# EAGLE board AI_Starter_Kit_for_Jetson_Nano_V1.0 (EAGLE 9.5.1), part 1 of 3
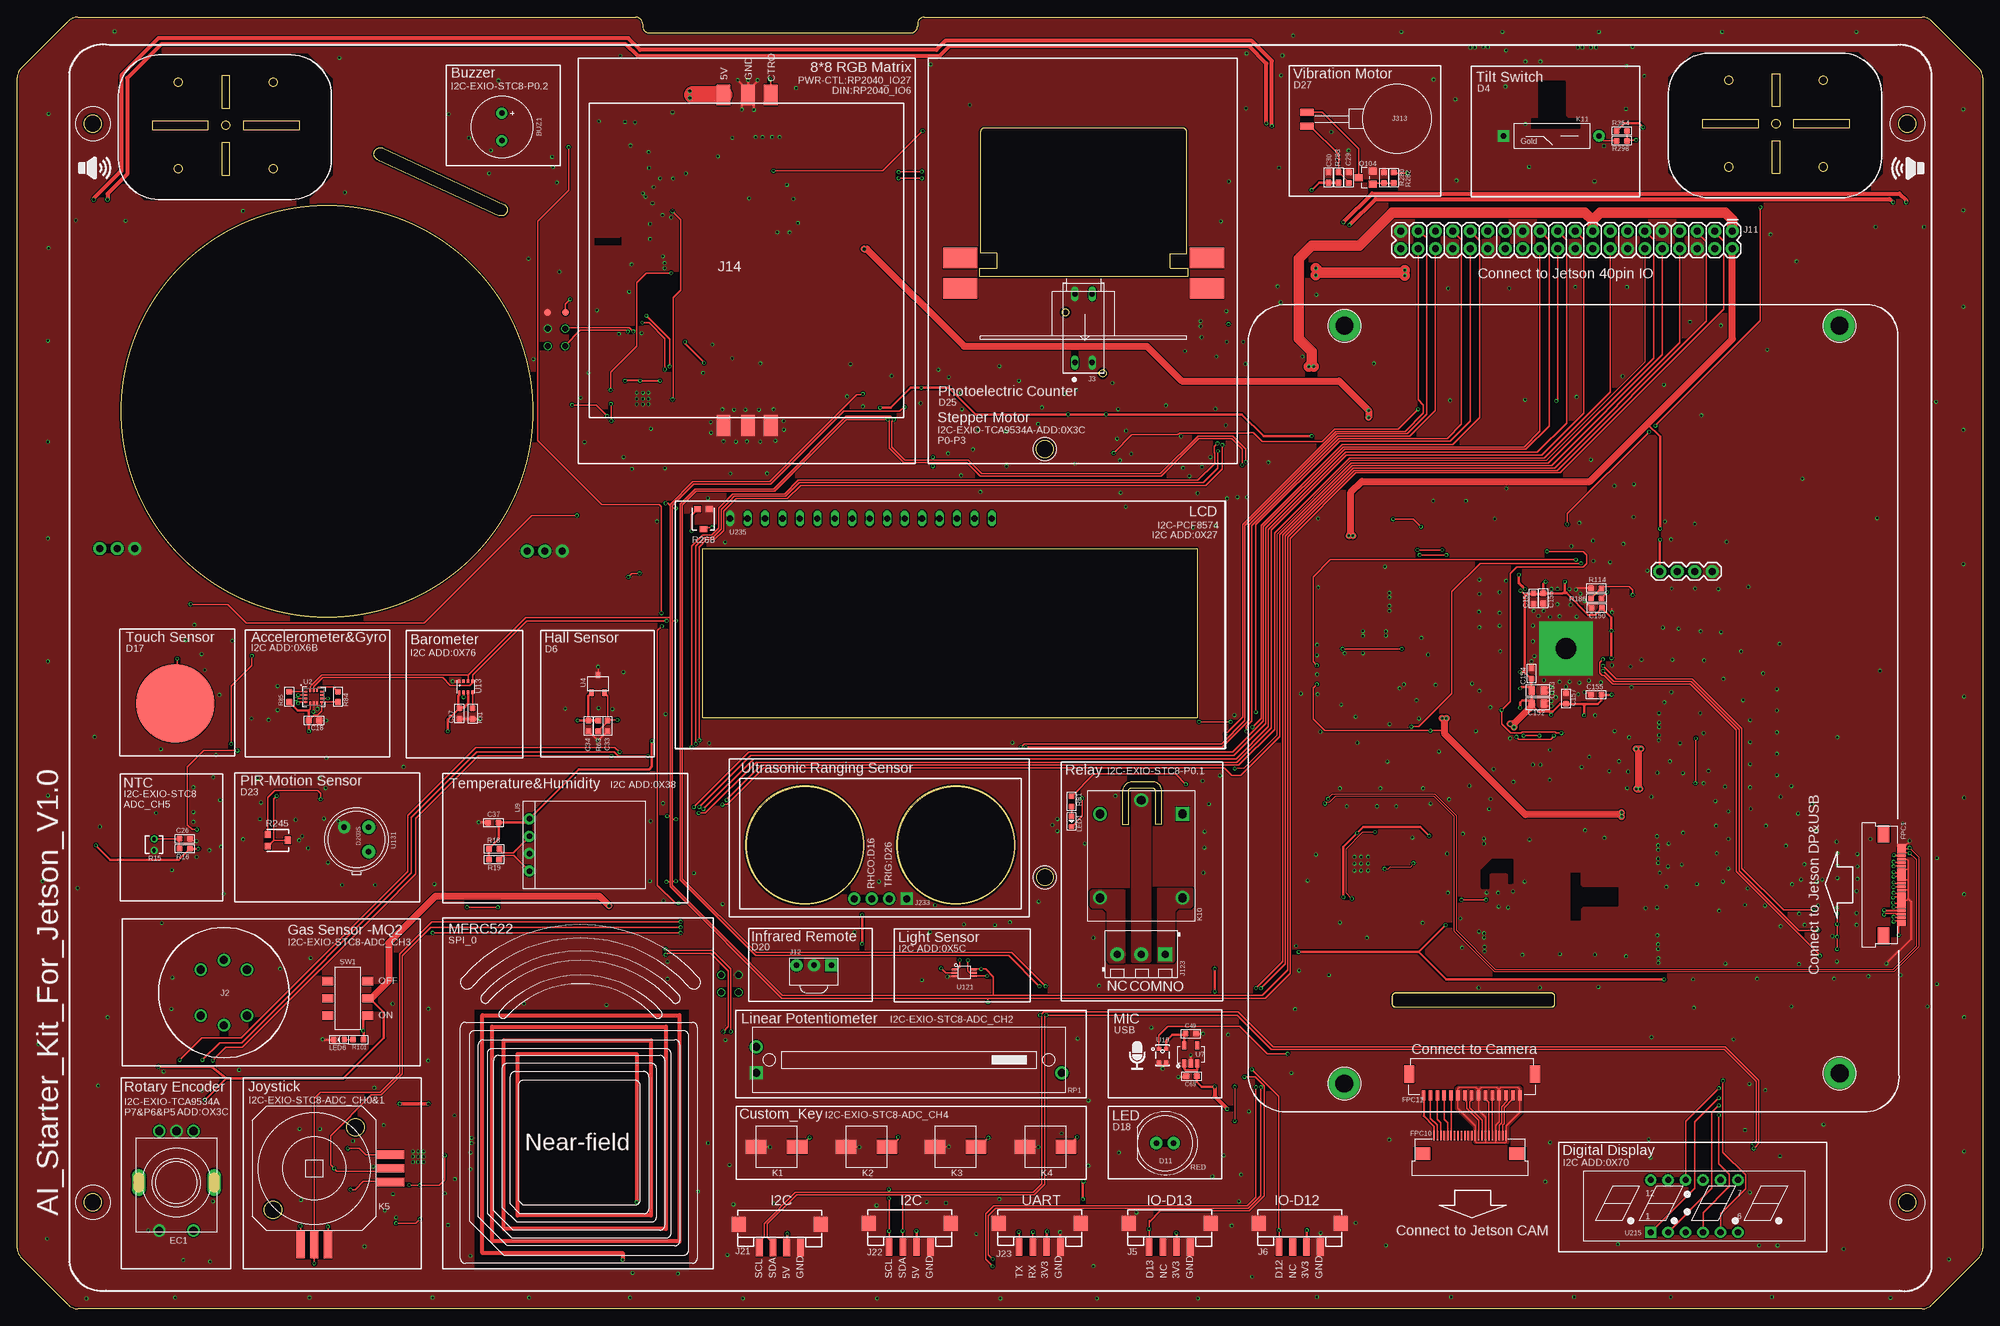
[diagram p7: board, top side]
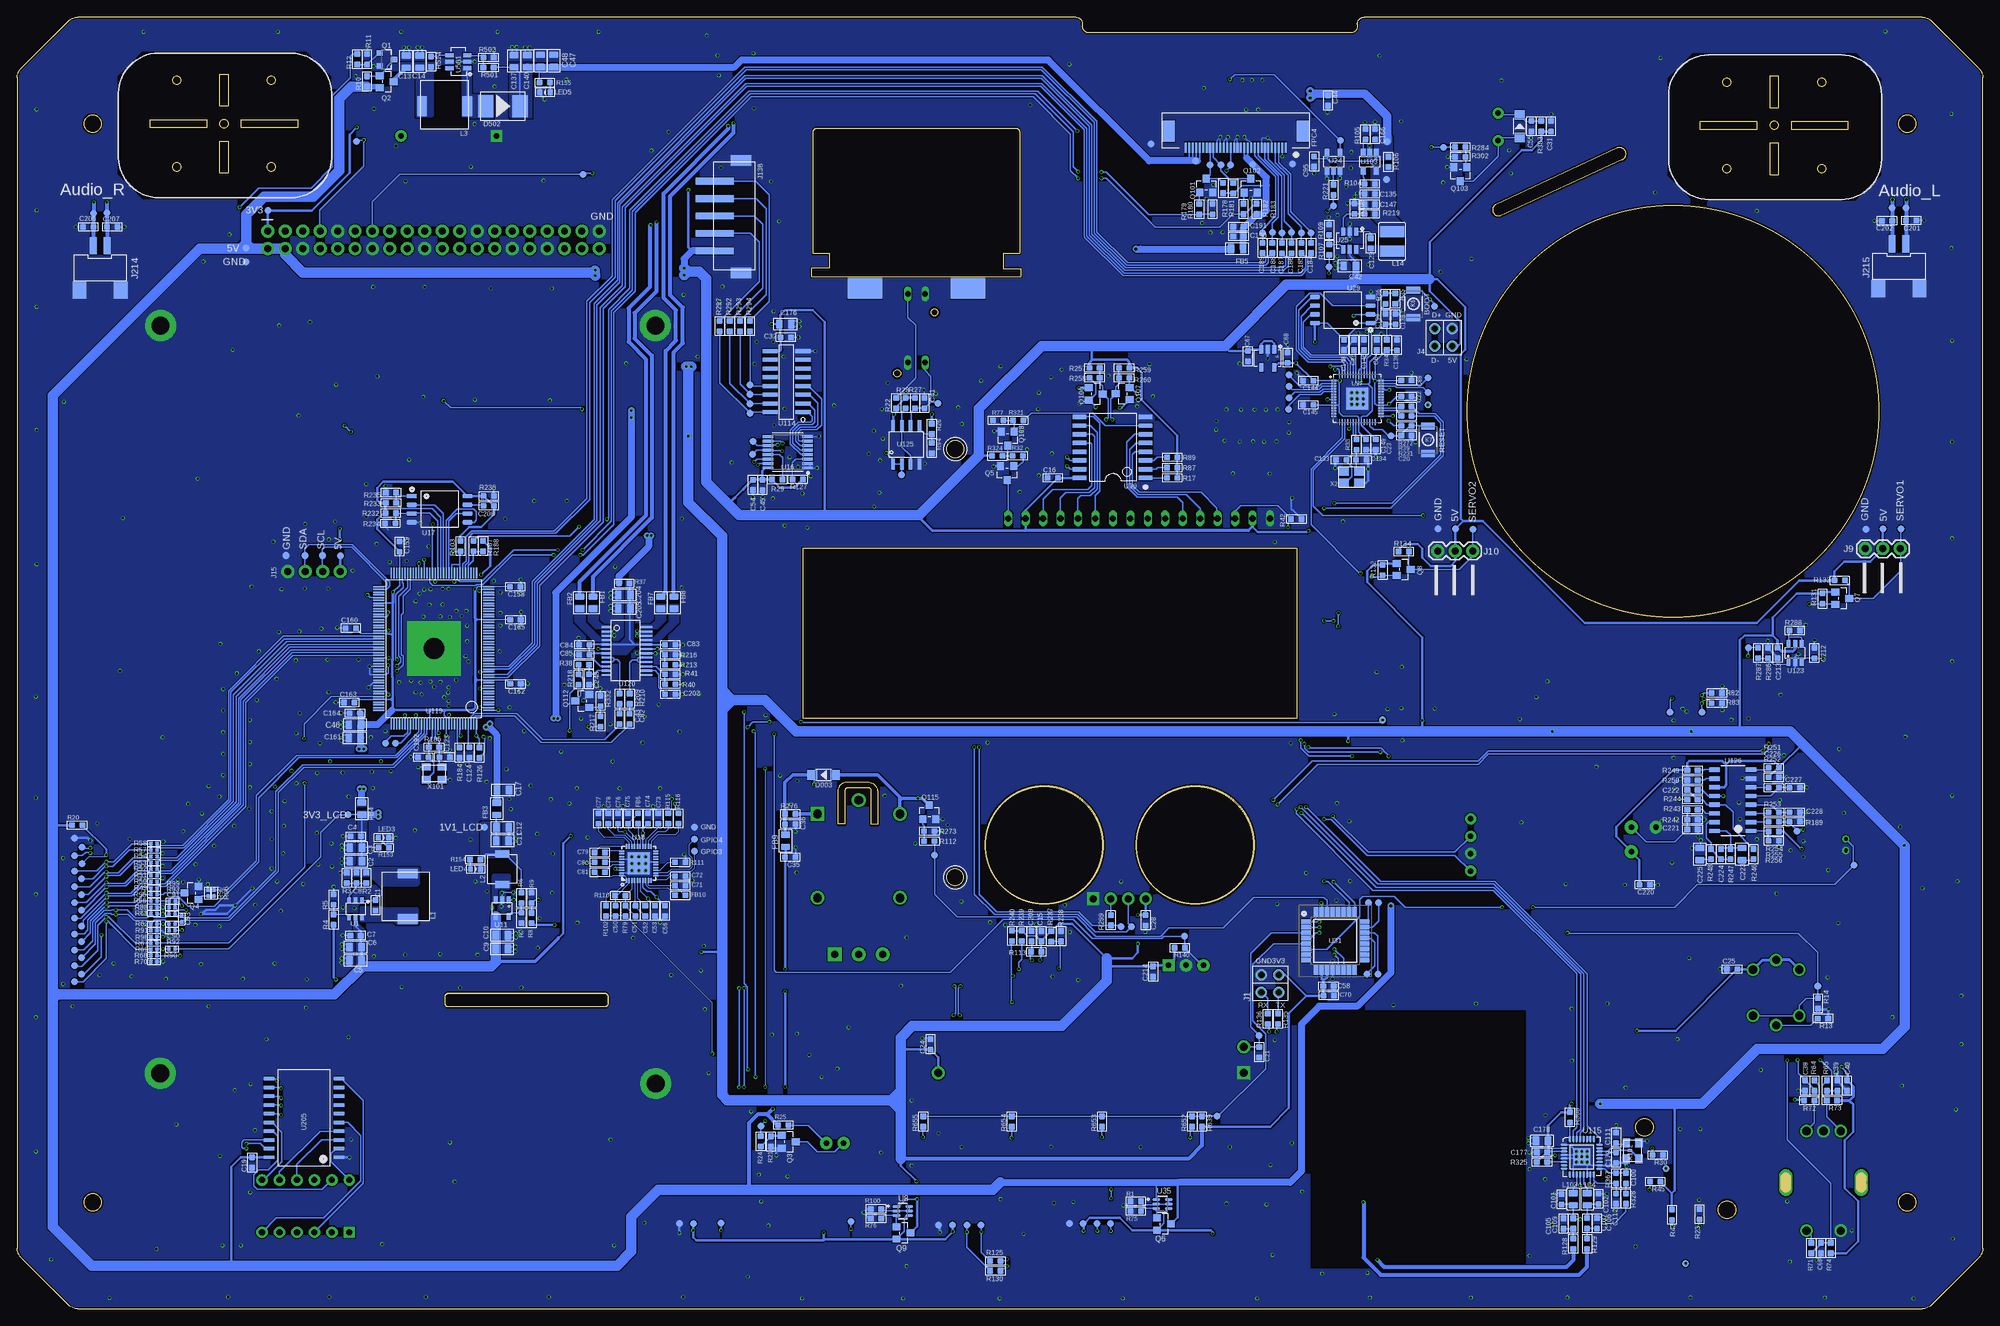
[diagram p8: board, bottom side, seen from below]

Size 286 x 188 mm. Coordinates in mm from the lower left corner, seen from the top.
Outline: 140.66,171.83 arc90 140.16,171.33
Outline: 223.75,45.35 arc90 223.17,45.92
Outline: 223.25,43.92 arc90 223.75,44.42
Outline: 200.05,44.42 arc90 200.55,43.92
Outline: 200.55,45.92 arc90 200.05,45.42
Outline: 170.16,171.33 arc90 169.66,171.83
Outline: 200.55,43.92 223.25,43.92
Outline: 223.17,45.92 200.55,45.92
Outline: 170.16,171.33 170.16,153.56 167.77,153.56 167.77,151.46 170.36,151.46 170.36,150.23 139.96,150.23 139.96,151.43 142.55,151.43 142.55,153.63 140.16,153.63 140.16,171.33
Outline: 200.05,45.42 200.05,44.42
Outline: 223.75,44.42 223.75,45.35
Outline: 169.66,171.83 140.66,171.83
Outline: 140.66,171.83 arc90 140.16,171.33
Outline: 223.75,45.35 arc90 223.17,45.92
Outline: 223.25,43.92 arc90 223.75,44.42
Outline: 200.05,44.42 arc90 200.55,43.92
Outline: 200.55,45.92 arc90 200.05,45.42
Outline: 170.16,171.33 arc90 169.66,171.83
Outline: 166.5,70.55 166.5,75.27 arc90 165.44,76.67 162.13,76.67 arc90 160.79,74.99 160.79,70.47 161.72,70.47 161.72,75.3 arc-90 162.03,75.81 165.13,75.81 arc-90 165.62,75.33 165.62,70.55 166.5,70.55
Outline: 266.64,171.9 266.64,173.1 258.44,173.1 258.44,171.9 266.64,171.9
Outline: 256.51,179.73 255.31,179.73 255.31,175.03 256.51,175.03 256.51,179.73
Outline: 253.38,173.1 245.18,173.1 245.18,171.9 253.38,171.9 253.38,173.1
Outline: 256.51,169.97 255.31,169.97 255.31,165.27 256.51,165.27 256.51,169.97
Outline: 41.08,171.65 41.08,172.85 32.88,172.85 32.88,171.65 41.08,171.65
Outline: 30.95,179.48 29.75,179.48 29.75,174.78 30.95,174.78 30.95,179.48
Outline: 27.82,172.85 19.62,172.85 19.62,171.65 27.82,171.65 27.82,172.85
Outline: 30.95,169.72 29.75,169.72 29.75,165.02 30.95,165.02 30.95,169.72
Outline: 200.54,43.96 223.24,43.96 arc90 223.74,44.46 223.74,45.46 arc90 223.24,45.96 200.54,45.96 arc90 200.04,45.46 200.04,44.46 arc90 200.54,43.96
Outline: 200.53,43.94 223.23,43.94 arc90 223.73,44.44 223.73,45.44 arc90 223.23,45.94 200.53,45.94 arc90 200.03,45.44 200.03,44.44 arc90 200.53,43.94
Outline: 0.59,180.59 7.41,187.41 arc-45 8.83,188 90,188 arc-90 91,187 91,186.7 arc90 92,185.7 130,185.7 arc90 131,186.7 131,187 arc-90 132,188 277.17,188 arc-45 278.59,187.41 285.41,180.59 arc-45 286,179.17 286,8.83 arc-45 285.41,7.41 278.59,0.59 arc-45 277.17,0 8.83,0 arc-45 7.41,0.59 0.59,7.41 arc-45 0,8.83 0,179.17 arc-45 0.59,180.59
Outline: 52.46,167.23 70.16,159.13 arc174 70.86,160.73 53.26,168.93 arc180 52.46,167.23
Outline: circle at 249.01,166.2 radius 0.6
Outline: circle at 262.81,166.2 radius 0.6
Outline: circle at 255.91,172.5 radius 0.6
Outline: circle at 249.01,178.8 radius 0.6
Outline: circle at 262.81,178.8 radius 0.6
Outline: circle at 249.01,166.2 radius 0.6
Outline: circle at 262.81,166.2 radius 0.6
Outline: circle at 255.91,172.5 radius 0.6
Outline: circle at 262.81,178.8 radius 0.6
Outline: circle at 249.01,178.8 radius 0.6
Outline: circle at 45.05,130.61 radius 29.95
Outline: circle at 249.01,166.2 radius 0.6
Outline: circle at 262.81,166.2 radius 0.6
Outline: circle at 255.91,172.5 radius 0.6
Outline: circle at 262.81,178.8 radius 0.6
Outline: circle at 249.01,178.8 radius 0.6
Outline: circle at 23.45,165.95 radius 0.6
Outline: circle at 37.25,165.95 radius 0.6
Outline: circle at 30.35,172.25 radius 0.6
Outline: circle at 23.45,178.55 radius 0.6
Copper layers (1*16): Top 0.035mm / dielectric 1.5mm / Bottom 0.035mm
Design rules "default *": minimum track width 6mil, minimum drill 0.3mm, track to track 6mil, track to pad 6mil, pad to pad 6mil, via to via 6mil, smd to smd 6mil, copper to edge 10mil, drill to drill 6mil, minimum pad ring 3mil, minimum via ring 4mil, stop-mask expansion 4mil, vias tented up to drill 100mil, thermal gap 0mil
Net classes: 0 default: width 0.1 mm, drill 0.3 mm; 1 PWR: width 0.4 mm, drill 0.25 mm; 2 gnd: width 0.15 mm, drill 0.3 mm, clearance 0.152 mm; 4 USB: width 0.203 mm, clearance 0.152 mm

## Footprints (pad centres in the part's own frame; a part is rotated, then mirrored left to right if it is on the bottom)
BUZZER_0955_DIP = drill 0.8 pad 1.6: 1 -2,0; 2 2,0
C0603 = smd 0.889 x 0.889: 1 -0.762,0; 2 0.762,0
C0805 = smd 1.016 x 1.397: 1 -0.889,0; 2 0.889,0
C0402 = smd 0.584 x 0.584: 1 -0.45,0; 2 0.45,0
D_SOD123 = smd 1.397 x 1.397: + -1.651,0; - 1.651,0
LED-8MM = drill 0.8 pad 1.8: 1 -1.27,0; 2 1.27,0
214AB = smd 2.2 x 3.2: 1 -2.5,0; 2 2.5,0
5P-13.75X11.7X6.5H = drill 1.2 pad 1.8: 1 -2.5,-7.5; 2 0,-7.5; 3 2.5,-7.5; 4 2.5,7; 5 -2.5,7 | drill 1.5 pad 2 long: P1 -5.5,0; P2 5.5,0
L0805 = smd 1.016 x 1.397: 1 -0.889,0; 2 0.889,0
L0603 = smd 0.889 x 0.889: 1 -0.762,0; 2 0.762,0
FPC_24PIN_0.5_4.3_1 = smd 0.3 x 1.3: 1 6.41,2.53; 2 5.91,2.53; 3 5.41,2.53; 4 4.91,2.53; 5 4.41,2.53; 6 3.91,2.53; 7 3.41,2.53; 8 2.91,2.53; 9 2.41,2.53; 10 1.91,2.53; 11 1.41,2.53; 12 0.91,2.53; 13 0.41,2.53; 14 -0.09,2.53; 15 -0.59,2.53; 16 -1.09,2.53; 17 -1.59,2.53; 18 -2.09,2.53; 19 -2.59,2.53; 20 -3.09,2.53; 21 -3.59,2.53; 22 -4.09,2.53; 23 -4.59,2.53; 24 -5.09,2.53 | smd 2.5 x 1.8: 25 -6.754,-0.06; 26 8.06,-0.06
30P*0.5MM = smd 0.3 x 1.5: P$1 -6.35,2.54; P$2 -5.85,2.54; P$3 -5.35,2.54; P$4 -4.85,2.54; P$5 -4.35,2.54; P$6 -3.85,2.54; P$7 -3.35,2.54; P$8 -2.85,2.54; P$9 -2.35,2.54; P$10 -1.85,2.54; P$11 -1.35,2.54; P$12 -0.85,2.54; P$13 -0.35,2.54; P$14 0.15,2.54; P$15 0.65,2.54; P$16 1.15,2.54; P$17 1.65,2.54; P$18 2.15,2.54; P$19 2.65,2.54; P$20 3.15,2.54; P$21 3.65,2.54; P$22 4.15,2.54; P$23 4.65,2.54; P$24 5.15,2.54; P$25 5.65,2.54; P$26 6.15,2.54; P$27 6.65,2.54; P$28 7.15,2.54; P$29 7.65,2.54; P$30 8.15,2.54 | smd 1.8 x 3: P$31 -8.85,0.14; P$32 10.65,0.14
FPC_22PIN_0.5_4.3_1 = smd 0.3 x 1.3: 1 5.14,2.53; 2 4.64,2.53; 3 4.14,2.53; 4 3.64,2.53; 5 3.14,2.53; 6 2.64,2.53; 7 2.14,2.53; 8 1.64,2.53; 9 1.14,2.53; 10 0.64,2.53; 11 0.14,2.53; 12 -0.36,2.53; 13 -0.86,2.53; 14 -1.36,2.53; 15 -1.86,2.53; 16 -2.36,2.53; 17 -2.86,2.53; 18 -3.36,2.53; 19 -3.86,2.53; 20 -4.36,2.53; 21 -4.86,2.53; 22 -5.36,2.53 | smd 2.5 x 1.8: 23 -7.024,-0.06; 24 6.79,-0.06
FPC_P1.0MM_15P_SMD = smd 0.5 x 1.5: P$1 7.025,-2.539; P$2 6.025,-2.539; P$3 5.025,-2.539; P$4 4.025,-2.539; P$5 3.025,-2.539; P$6 2.025,-2.539; P$7 1.025,-2.539; P$8 0.025,-2.539; P$9 -0.975,-2.539; P$10 -1.975,-2.539; P$11 -2.975,-2.539; P$12 -3.975,-2.539; P$13 -4.975,-2.539; P$14 -5.975,-2.539; P$15 -6.975,-2.539 | smd 1.5 x 2.5: P$16 9.225,0.561; P$17 -9.075,0.561
P4_2.54*4_VIA = drill 0.889 pad 1.1: 1 1.27,1.27; 2 1.27,-1.27; 3 -1.27,1.27; 4 -1.27,-1.27 | smd 1.651 x 1.651: 1-1 1.27,1.27; 2-1 1.27,-1.27; 3-1 -1.27,1.27; 4-1 -1.27,-1.27
MQ2 = drill 1.2 pad 1.8: 1 0,-6.718; 2 -1.391,-3.359; 3 0,0; 4 6.718,0; 5 8.109,-3.359; 6 6.718,-6.718
2*2P-IR928 = drill 0.8 long: 1 1.5,1.75; 2 1.5,4.25; 3 11.5,4.25; 4 11.5,1.75
4P-SMD-2.0 = smd 0.965 x 2.54: 1 -3,0; 2 -1,0; 3 1,0; 4 3,0 | smd 2.032 x 2.184: SS1 -5.946,3.4; SS2 5.946,3.4
1X03 = drill 1.016 pad 1.88: 1 0,0; 2 2.54,0; 3 5.08,0
2X20 = drill 1.016 pad 1.88: 1 0,0; 2 0,2.54; 3 2.54,0; 4 2.54,2.54; 5 5.08,0; 6 5.08,2.54; 7 7.62,0; 8 7.62,2.54; 9 10.16,0; 10 10.16,2.54; 11 12.7,0; 12 12.7,2.54; 13 15.24,0; 14 15.24,2.54; 15 17.78,0; 16 17.78,2.54; 17 20.32,0; 18 20.32,2.54; 19 22.86,0; 20 22.86,2.54; 21 25.4,0; 22 25.4,2.54; 23 27.94,0; 24 27.94,2.54; 25 30.48,0; 26 30.48,2.54; 27 33.02,0; 28 33.02,2.54; 29 35.56,0; 30 35.56,2.54; 31 38.1,0; 32 38.1,2.54; 33 40.64,0; 34 40.64,2.54; 35 43.18,0; 36 43.18,2.54; 37 45.72,0; 38 45.72,2.54; 39 48.26,0; 40 48.26,2.54
VS1838B-SIP3 = drill 0.8 pad 1.8 square: 1 -2.54,0 | drill 0.8 pad 1.8: 2 0,0; 3 2.54,0
RGB64*64AMD = smd 2 x 3: 1 -3.302,22.479; 2 0.254,22.479; 3 3.556,22.479; 4 3.556,-25.654; 5 0.254,-25.654; 6 -3.302,-25.654
1X04 = drill 1.016 pad 1.88: 1 0,0; 2 2.54,0; 3 5.08,0; 4 7.62,0
3.5MM*3P = drill 1.016 pad 2.032 square: 1 -3.5,0 | drill 1.016 pad 2.032: 2 0,0; 3 3.5,0
CROWPI_POW_SMD-5P*2.54 = smd 5.5 x 1: P$1 4.35,5.08; P$2 4.35,2.54; P$3 4.35,0; P$4 4.35,-2.54; P$5 4.35,-5.08 | smd 3 x 1.5: P$6 0.52,-8.08; P$7 0.52,8.28
1X02L = smd 1 x 2.5: 1 0,0; 2 2,0 | smd 2 x 2.5: 3 -2,-6.5; 4 4,-6.5
ULTRA = drill 1 pad 1.778 square: P$1 3.81,0 | drill 1 pad 1.778: P$2 1.27,0; P$3 -1.27,0; P$4 -3.81,0
MOTOR_1CM = smd 1 x 2: P$1 1.083,-11.822; P$2 -0.956,-11.822
BUTTON_2P = smd 3 x 2: P$1 0,0; P$2 6,0
ROCKER = smd 4 x 1.2: P$1 -11.07,2; P$2 -11.07,0; P$3 -11.07,-2 | smd 1.2 x 4: P$4 -2,-11.07; P$5 0,-11.07; P$6 2,-11.07
157SW = smd 1.016 x 1.981: 1 0,0; 2 4,0
REY5-6-19.1X15.5X15.3MM = drill 1.3 pad 2 square: 1 -6.1,6 | drill 1.3 pad 2: 2 -8.1,0; 3 -6.1,-6; 4 6.1,6; 5 6.1,-6
TILT = drill 0.8 pad 1.676 square: 1 7.677,-0.244 | drill 0.8 pad 1.676: 2 -6.223,-0.244
L773 = smd 1.5 x 3: 1 -3.29,-0.254; 2 3.29,-0.254
L0420 = smd 2 x 1: 1 0,2.2; 2 0,-2.2
CD32 = smd 3.5 x 1.6: 1 0,1.409; 2 0,-1.409
0805@1 = smd 1.016 x 1.397: 1 -0.889,0; 2 0.889,0
DISCRETE_LED-0603 = smd 0.762 x 0.889: + -0.762,0; - 0.762,0
M2 = drill 2.6 pad 4.5: P$1 0,0
PAD-1.0MM = smd 1 x 1: P$1 0,0
TEST_PAD-1.0MM = smd 1 x 1: P$1 0,0
1P-D450 = smd 11.43 x 11.43: 1 0,0
SOT23-3 = smd 0.8 x 0.9: 1 -0.95,-1; 2 0.95,-1; 3 0,1.1
PMOS_SOT23 = smd 1.016 x 1.143: 1 -0.889,-1.016; 2 0.889,-1.016; 3 0,1.016
SOT23@1 = smd 1.016 x 1.143: 1 -0.95,-1.016; 2 0.95,-1.016; 3 0,1.016
SOT23 = smd 1.016 x 1.143: 1 -0.889,-1.016; 2 0.889,-1.016; 3 0,1.016
R0603 = smd 0.889 x 0.889: 1 -0.762,0; 2 0.762,0
RES-TH_L2.5-W2.5-P1.70-D0.3 = drill 0.55 pad 1: 1 -0.85,0; 2 0.85,0
R0402 = smd 0.584 x 0.584: 1 -0.445,0; 2 0.445,0
3P-SMD-SQUA-3.6X3.3 = smd 1 x 0.9: 1 -0.85,-1.45; 3 0.85,-1.45 | smd 1.1 x 0.9: 2 0,1.45
3P-SQUA-45.6X10X5.8H = drill 1.143 pad 1.905 square: 1 -22.225,-1.905 | drill 1.143 pad 1.905: 2 -22.225,1.905; 3 22.225,-1.905
SWITCH_6PIN_2P = smd 1.2 x 1.6: 1 2.5,-2.9; 2 0,-2.9; 3 -2.5,-2.9; 4 -2.5,2.9; 5 0,2.9; 6 2.5,2.9
SOT23-6L = smd 0.5 x 0.9: 1 -0.961,-1.212; 2 -0.011,-1.212; 3 0.94,-1.212; 4 0.94,1.288; 5 -0.011,1.288; 6 -0.961,1.288
LGA-14L = smd 0.475 x 0.25: 1 -1.163,0.75; 2 -1.163,0.25; 3 -1.163,-0.25; 4 -1.163,-0.75; 8 1.163,-0.75; 9 1.163,-0.25; 10 1.163,0.25; 11 1.163,0.75 | smd 0.25 x 0.475: 5 -0.5,-0.912; 6 0,-0.912; 7 0.5,-0.912; 12 0.5,0.912; 13 0,0.912; 14 -0.5,0.912
SOT-23W = smd 0.7 x 0.9: 1 -0.95,-1.3; 2 0.95,-1.3; 3 0,1.3
SOT23-5 = smd 0.6 x 1.2: 1 -0.95,-1.3; 2 0,-1.3; 3 0.95,-1.3; 4 0.95,1.3; 5 -0.95,1.3
SOT-363 = smd 1.09 x 0.4: 1 -0.92,0.65; 2 -0.92,0; 3 -0.92,-0.65; 4 0.92,-0.65; 5 0.92,0; 6 0.92,0.65
CROWTAIL-DHT20-V1.0-20211013_DHT20 = drill 0.8 pad 1.6: 1 -3.81,0; 2 -1.27,0; 3 1.27,0; 4 3.81,0
IC_SOT23-5 = smd 0.6 x 1: 1 -0.95,-1.2; 2 0,-1.2; 3 0.95,-1.2; 4 0.95,1.2; 5 -0.95,1.2
LGA8-0.65-2X2.5X0.95MM = smd 0.5 x 0.35: 1 0.8,0.975; 2 0.8,0.325; 3 0.8,-0.325; 4 0.8,-0.975; 5 -0.8,-0.975; 6 -0.8,-0.325; 7 -0.8,0.325; 8 -0.8,0.975
SOP65P640X120-16N = smd 1.572 x 0.41: 1 -2.872,2.275; 2 -2.872,1.625; 3 -2.872,0.975; 4 -2.872,0.325; 5 -2.872,-0.325; 6 -2.872,-0.975; 7 -2.872,-1.625; 8 -2.872,-2.275; 9 2.872,-2.275; 10 2.872,-1.625; 11 2.872,-0.975; 12 2.872,-0.325; 13 2.872,0.325; 14 2.872,0.975; 15 2.872,1.625; 16 2.872,2.275
LORA_RA-08H_DEV_SELF_SOIC-8-208MIL = smd 1.5 x 0.635: 1 -4.05,1.905; 2 -4.05,0.635; 3 -4.05,-0.635; 4 -4.05,-1.905; 5 4.05,-1.905; 6 4.05,-0.635; 7 4.05,0.635; 8 4.05,1.905
QFN40_EP = smd 0.67 x 0.2: 1 -2.514,1.8 | smd 0.75 x 0.2: 2 -2.474,1.4; 3 -2.474,1; 4 -2.474,0.6; 5 -2.474,0.2; 6 -2.474,-0.2; 7 -2.474,-0.6; 8 -2.474,-1; 9 -2.474,-1.4; 10 -2.474,-1.8; 21 2.474,-1.8; 22 2.474,-1.4; 23 2.474,-1; 24 2.474,-0.6; 25 2.474,-0.2; 26 2.474,0.2; 27 2.474,0.6; 28 2.474,1; 29 2.474,1.4; 30 2.474,1.8 | smd 0.199 x 0.75: 11 -1.8,-2.474 | smd 0.2 x 0.75: 12 -1.4,-2.474; 13 -1,-2.474; 14 -0.6,-2.474; 15 -0.2,-2.474; 16 0.2,-2.474; 17 0.6,-2.474; 18 1,-2.474; 19 1.4,-2.474; 20 1.8,-2.474; 31 1.8,2.474; 32 1.4,2.474; 33 1,2.474; 34 0.6,2.474; 35 0.2,2.474; 36 -0.2,2.474; 37 -0.6,2.474; 38 -1,2.474; 39 -1.4,2.474; 40 -1.8,2.474 | smd 3.2 x 3.2: 41 0,0
LGA-4(1.9X2.8) = smd 0.6 x 0.6: 1 -0.525,0.995; 2 -0.525,-0.995; 3 0.525,-0.995; 4 0.525,0.995
SOT23-5' = smd 0.69 x 1.2: 1 -0.95,-1.3; 2 0,-1.3; 3 0.95,-1.3; 4 0.95,1.3; 5 -0.95,1.3
MT2492-SOT23-6 = smd 0.6 x 1.2: 1 -0.95,-1.3; 2 0,-1.3; 3 0.95,-1.3; 4 0.95,1.3; 5 0,1.3; 6 -0.95,1.3
RP2040_QFN-56 = smd 0.875 x 0.2: 1 -3.437,2.6; 2 -3.437,2.2; 3 -3.437,1.8; 4 -3.437,1.4; 5 -3.437,1; 6 -3.437,0.6; 7 -3.437,0.2; 8 -3.437,-0.2; 9 -3.437,-0.6; 10 -3.437,-1; 11 -3.437,-1.4; 12 -3.437,-1.8; 13 -3.437,-2.2; 14 -3.437,-2.6; 29 3.437,-2.6; 30 3.437,-2.2; 31 3.437,-1.8; 32 3.437,-1.4; 33 3.437,-1; 34 3.437,-0.6; 35 3.437,-0.2; 36 3.437,0.2; 37 3.437,0.6; 38 3.437,1; 39 3.437,1.4; 40 3.437,1.8; 41 3.437,2.2; 42 3.437,2.6 | smd 0.2 x 0.875: 15 -2.6,-3.437; 16 -2.2,-3.437; 17 -1.8,-3.437; 18 -1.4,-3.437; 19 -1,-3.437; 20 -0.6,-3.437; 21 -0.2,-3.437; 22 0.2,-3.437; 23 0.6,-3.437; 24 1,-3.437; 25 1.4,-3.437; 26 1.8,-3.437; 27 2.2,-3.437; 28 2.6,-3.437; 43 2.6,3.437; 44 2.2,3.437; 45 1.8,3.437; 46 1.4,3.437; 47 1,3.437; 48 0.6,3.437; 49 0.2,3.437; 50 -0.2,3.437; 51 -0.6,3.437; 52 -1,3.437; 53 -1.4,3.437; 54 -1.8,3.437; 55 -2.2,3.437; 56 -2.6,3.437 | smd 3.2 x 3.2: EPAD 0,0
SELF_SOIC-8-208MIL = smd 1.5 x 0.635: 1 -4.05,1.905; 2 -4.05,0.635; 3 -4.05,-0.635; 4 -4.05,-1.905; 5 4.05,-1.905; 6 4.05,-0.635; 7 4.05,0.635; 8 4.05,1.905
QFP80P900X900X165-32N = smd 1.475 x 0.6: 1 -4.238,2.8; 2 -4.238,2; 3 -4.238,1.2; 4 -4.238,0.4; 5 -4.238,-0.4; 6 -4.238,-1.2; 7 -4.238,-2; 8 -4.238,-2.8; 17 4.238,-2.8; 18 4.238,-2; 19 4.238,-1.2; 20 4.238,-0.4; 21 4.238,0.4; 22 4.238,1.2; 23 4.238,2; 24 4.238,2.8 | smd 0.6 x 1.475: 9 -2.8,-4.238; 10 -2,-4.238; 11 -1.2,-4.238; 12 -0.4,-4.238; 13 0.4,-4.238; 14 1.2,-4.238; 15 2,-4.238; 16 2.8,-4.238; 25 2.8,4.238; 26 2,4.238; 27 1.2,4.238; 28 0.4,4.238; 29 -0.4,4.238; 30 -1.2,4.238; 31 -2,4.238; 32 -2.8,4.238
SO-16-300MIL = smd 0.635 x 2: P$1 0,0; P$2 1.27,0; P$3 2.54,0; P$4 3.81,0; P$5 5.08,0; P$6 6.35,0; P$7 7.62,0; P$8 8.89,0; P$9 8.89,9.6; P$10 7.62,9.6; P$11 6.35,9.6; P$12 5.08,9.6; P$13 3.81,9.6; P$14 2.54,9.6; P$15 1.27,9.6; P$16 0,9.6
IC_SOT23-5' = smd 0.69 x 1.2: 1 -0.95,-1.3; 2 0,-1.3; 3 0.95,-1.3; 4 0.95,1.3; 5 -0.95,1.3
ULN2003D = smd 2.2 x 0.6: 1 0,0; 2 0,-1.27; 3 0,-2.54; 4 0,-3.81; 5 0,-5.08; 6 0,-6.35; 7 0,-7.62; 8 0,-8.89; 9 4.8,-8.89; 10 4.8,-7.62; 11 4.8,-6.35; 12 4.8,-5.08; 13 4.8,-3.81; 14 4.8,-2.54; 15 4.8,-1.27; 16 4.8,0
RC522 = smd 1 x 0.3: 1 0.175,0; 2 0.175,-0.5; 3 0.175,-1; 4 0.175,-1.5; 5 0.175,-2; 6 0.175,-2.5; 7 0.175,-3; 8 0.175,-3.5; 17 5.337,-3.501; 18 5.337,-3; 19 5.337,-2.5; 20 5.337,-2; 21 5.337,-1.5; 22 5.337,-1; 23 5.337,-0.5; 24 5.337,0 | smd 0.3 x 1: 9 1.005,-4.332; 10 1.5,-4.332; 11 2,-4.332; 12 2.5,-4.332; 13 3,-4.332; 14 3.5,-4.332; 15 4,-4.332; 16 4.5,-4.332; 25 4.505,0.831; 26 4,0.831; 27 3.5,0.831; 28 3,0.831; 29 2.5,0.831; 30 2,0.831; 31 1.5,0.831; 32 1,0.831 | smd 2.5 x 2.5: 33 2.756,-1.751
IC_RTD2556_LQFP156_14X20 = smd 0.2 x 1.6: 1 -9,-8; 2 -8.6,-8; 3 -8.2,-8; 4 -7.8,-8; 5 -7.4,-8; 6 -7,-8; 7 -6.6,-8; 8 -6.2,-8; 9 -5.8,-8; 10 -5.4,-8; 11 -5,-8; 12 -4.6,-8; 13 -4.2,-8; 14 -3.8,-8; 15 -3.4,-8; 16 -3,-8; 17 -2.6,-8; 18 -2.2,-8; 19 -1.8,-8; 20 -1.4,-8; 21 -1,-8; 22 -0.6,-8; 23 -0.2,-8; 24 0.2,-8; 25 0.6,-8; 26 1,-8; 27 1.4,-8; 28 1.8,-8; 29 2.2,-8; 30 2.6,-8; 31 3,-8; 32 3.4,-8; 33 3.8,-8; 34 4.2,-8; 35 4.6,-8; 36 5,-8; 37 5.4,-8; 38 5.8,-8; 39 6.2,-8; 40 6.6,-8; 41 7,-8; 42 7.4,-8; 43 7.8,-8; 44 8.2,-8; 45 8.6,-8; 46 9,-8; 79 9,8; 80 8.6,8; 81 8.2,8; 82 7.8,8; 83 7.4,8; 84 7,8; 85 6.6,8; 86 6.2,8; 87 5.8,8; 88 5.4,8; 89 5,8; 90 4.6,8; 91 4.2,8; 92 3.8,8; 93 3.4,8; 94 3,8; 95 2.6,8; 96 2.2,8; 97 1.8,8; 98 1.4,8; 99 1,8; 100 0.6,8; 101 0.2,8; 102 -0.2,8; 103 -0.6,8; 104 -1,8; 105 -1.4,8; 106 -1.8,8; 107 -2.2,8; 108 -2.6,8; 109 -3,8; 110 -3.4,8; 111 -3.8,8; 112 -4.2,8; 113 -4.6,8; 114 -5,8; 115 -5.4,8; 116 -5.8,8; 117 -6.2,8; 118 -6.6,8; 119 -7,8; 120 -7.4,8; 121 -7.8,8; 122 -8.2,8; 123 -8.6,8; 124 -9,8 | smd 1.6 x 0.2: 47 11,-6.2; 48 11,-5.8; 49 11,-5.4; 50 11,-5; 51 11,-4.6; 52 11,-4.2; 53 11,-3.8; 54 11,-3.4; 55 11,-3; 56 11,-2.6; 57 11,-2.2; 58 11,-1.8; 59 11,-1.4; 60 11,-1; 61 11,-0.6; 62 11,-0.2; 63 11,0.2; 64 11,0.6; 65 11,1; 66 11,1.4; 67 11,1.8; 68 11,2.2; 69 11,2.6; 70 11,3; 71 11,3.4; 72 11,3.8; 73 11,4.2; 74 11,4.6; 75 11,5; 76 11,5.4; 77 11,5.8; 78 11,6.2; 125 -11,6.2; 126 -11,5.8; 127 -11,5.4; 128 -11,5; 129 -11,4.6; 130 -11,4.2; 131 -11,3.8; 132 -11,3.4; 133 -11,3; 134 -11,2.6; 135 -11,2.2; 136 -11,1.8; 137 -11,1.4; 138 -11,1; 139 -11,0.6; 140 -11,0.2; 141 -11,-0.2; 142 -11,-0.6; 143 -11,-1; 144 -11,-1.4; 145 -11,-1.8; 146 -11,-2.2; 147 -11,-2.6; 148 -11,-3; 149 -11,-3.4; 150 -11,-3.8; 151 -11,-4.2; 152 -11,-4.6; 153 -11,-5; 154 -11,-5.4; 155 -11,-5.8; 156 -11,-6.2 | drill 3 pad 7.8 square: 157 0,0
SSOP24 = smd 0.305 x 1.27: 1 0,0; 2 0.635,0; 3 1.27,0; 4 1.905,0; 5 2.54,0; 6 3.175,0; 7 3.81,0; 8 4.445,0; 9 5.08,0; 10 5.715,0; 11 6.35,0; 12 6.985,0 | smd 0.305 x 1.778: 13 6.985,5.842; 14 6.35,5.842; 15 5.715,5.842; 16 5.08,5.842; 17 4.445,5.842; 18 3.81,5.842; 19 3.175,5.842; 20 2.54,5.842; 21 1.905,5.842; 22 1.27,5.842; 23 0.635,5.842; 24 0,5.842
B1750 = smd 0.8 x 0.27: 1 0,0; 2 0,-0.5; 3 0,-1; 4 2.8,-1; 5 2.8,-0.5; 6 2.8,0
SOT23-6L' = smd 0.55 x 1.2: 1 -0.95,-1.3; 2 0,-1.3; 3 0.95,-1.3; 4 0.95,1.3; 5 0,1.3; 6 -0.95,1.3
SOP8@1 = smd 0.5 x 1.6: 1 -1.905,-2.8; 2 -0.635,-2.8; 3 0.635,-2.8; 4 1.905,-2.8; 5 1.905,2.8; 6 0.635,2.8; 7 -0.635,2.8; 8 -1.905,2.8
SOP16 = smd 0.635 x 1.524: 1 0,0; 2 1.27,0; 3 2.54,0; 4 3.81,0; 5 5.08,0; 6 6.35,0; 7 7.62,0; 8 8.89,0; 9 8.89,5.334; 10 7.62,5.334; 11 6.35,5.334; 12 5.08,5.334; 13 3.81,5.334; 14 2.54,5.334; 15 1.27,5.334; 16 0,5.334
PIR_MOTION_SENSOR_3P-D8.1MM = drill 0.8 pad 1.93: 1 1.778,1.778; 2 -1.778,1.778 | drill 0.8 pad 1.778: 3 -1.778,-1.778
HT16K33-SOP20 = smd 1.5 x 0.5: P$1 -5.08,5.08; P$2 -5.08,3.81; P$3 -5.08,2.54; P$4 -5.08,1.27; P$5 -5.08,0; P$6 -5.08,-1.27; P$7 -5.08,-2.54; P$8 -5.08,-3.81; P$9 -5.08,-5.08; P$10 -5.08,-6.35; P$11 5.12,-6.35; P$12 5.12,-5.08; P$13 5.12,-3.81; P$14 5.12,-2.54; P$15 5.12,-1.27; P$16 5.12,0; P$17 5.12,1.27; P$18 5.12,2.54; P$19 5.12,3.81; P$20 5.12,5.08
4-DIGITAL_DISPLAY = drill 0.889 pad 1.651 square: 1 -5.964,-4.229 | drill 0.889 pad 1.651: 2 -3.424,-4.229; 3 -0.884,-4.229; 4 1.656,-4.229; 5 4.196,-4.229; 6 6.736,-4.229; 7 6.736,3.391; 8 4.196,3.391; 9 1.656,3.391; 10 -0.884,3.391; 11 -3.424,3.391; 12 -5.964,3.391
LCD1206 = drill 0.9 long: P$1 -16.51,3.36; P$2 -13.97,3.36; P$3 -11.43,3.36; P$4 -8.89,3.36; P$5 -6.35,3.36; P$6 -3.81,3.36; P$7 -1.27,3.36; P$8 1.27,3.36; P$9 3.81,3.36; P$10 6.35,3.36; P$11 8.89,3.36; P$12 11.43,3.36; P$13 13.97,3.36; P$14 16.51,3.36; P$15 19.05,3.36; P$16 21.59,3.36
MT3608-SOT23-6 = smd 0.6 x 1.2: 1 -0.95,-1.3; 2 0,-1.3; 3 0.95,-1.3; 4 0.95,1.3; 5 0,1.3; 6 -0.95,1.3
PAD_5*3 = smd 5 x 3: P$1 0,0
A_XBJ_SMD3225 = smd 1.4 x 1.2: 1 -1.1,-0.85; 2 1.1,-0.85; 3 1.1,0.85; 4 -1.1,0.85
CRYSTAL-3.2-2.5 = smd 1.3 x 1.05: 1 -1.15,-0.925; 2 1.15,-0.925; 3 1.15,0.925; 4 -1.15,0.925

## Placement (x,y rotation side)
BUZ1  BUZZER_1295  [BUZZER_0955_DIP]  70.53,172.03 270 top
C1  22nF  [C0603]  233.85,58.74 270 bottom
C2  22uF  [C0805]  236.72,65.15 0 bottom
C3  22uF  [C0805]  236.72,67.11 0 bottom
C4  1uF  [C0603]  236.72,68.77 0 bottom
C5  22uF  [C0805]  236.77,50.71 0 bottom
C6  22uF  [C0805]  236.77,52.65 0 bottom
C7  1uF  [C0603]  236.77,54.34 0 bottom
C8  22pF  [C0603]  236.63,62.7 270 bottom
C9  22uF  [C0805]  215.47,52.38 180 bottom
C10  22uF  [C0805]  215.47,54.37 180 bottom
C11  22uF  [C0805]  215.4,68.12 180 bottom
C12  22uF  [C0805]  215.37,70.08 180 bottom
C13  22uF  [C0805]  229.42,181.54 270 bottom
C14  22uF  [C0805]  227.43,181.54 270 bottom
C15  1uF  [C0603]  136.97,54.24 270 bottom
C16  100nF  [C0603]  135.34,120.94 0 bottom
C17  22uF  [C0805]  215.32,75.53 180 bottom
C18  100nF  [C0603]  43.19,85.63 180 top
C19  100nF  [C0603]  251.81,21.29 90 bottom
C20  100nF  [C0603]  83.86,127.1 0 bottom
C21  100nF  [C0603]  105.27,37.35 90 bottom
C22  100nF  [C0603]  83.86,132.79 0 bottom
C23  100nF  [C0603]  88.33,125.77 270 bottom
C24  100nF  [C0603]  153.11,38.51 90 bottom
C25  100nF  [C0603]  36.48,49.44 0 bottom
C26  100nF  [C0603]  24.36,68.4 180 top
C27  100nF  [C0603]  64.33,86.63 90 top
C28  100nF  [C0603]  121.81,56.55 90 bottom
C29  100nF  [C0603]  193.75,164.63 270 top
C30  100nF  [C0603]  190.8,164.67 270 top
C31  100nF  [C0603]  62.82,172.13 270 bottom
C32  100nF  [C0603]  174.18,141.42 0 bottom
C33  1uF  [C0603]  85.88,84.84 270 top
C34  100nF  [C0603]  83.12,84.84 90 top
C35  100nF  [C0603]  173.5,65.72 180 bottom
C36  100nF  [C0603]  173.51,70.56 180 bottom
C37  100nF  [C0603]  69.29,70.76 180 top
C38  1nF  [C0603]  25.85,32.49 270 bottom
C39  1nF  [C0603]  21.17,32.49 270 bottom
C40  100nF  [C0603]  19.74,32.49 270 bottom
C41  10nF  [C0603]  153.99,131.83 270 bottom
C42  22uF  [C0805]  92.1,151.81 180 bottom
C43  1uF  [C0603]  198.35,85.84 270 bottom
C44  4.7uF  [C0603]  95.28,175.88 270 bottom
C45  4.7uF  [C0603]  177.56,119.92 270 bottom
C46  22uF  [C0805]  236.86,85.01 0 bottom
C47  22uF  [C0805]  207.92,181.65 90 bottom
C48  22uF  [C0805]  209.86,181.65 90 bottom
C49  100nF  [C0603]  170.76,40.03 180 top
C50  100nF  [C0603]  198.92,57.93 90 bottom
C51  220nF  [C0603]  196.06,57.93 90 bottom
C52  1uF  [C0603]  194.62,57.93 270 bottom
C53  1uF  [C0603]  193.19,57.93 270 bottom
C54  100nF  [C0603]  178.96,119.93 270 bottom
C55  100nF  [C0603]  65.69,172.13 90 bottom
C56  4.7uF  [C0603]  191.76,57.93 270 bottom
C58  100nF  [C0603]  95.2,46.96 180 bottom
C64  100nF  [C0603]  88.19,140.3 90 bottom
C66  1uF  [C0603]  23.56,8.84 90 bottom
C67  1uF  [C0603]  106.94,138.64 270 bottom
C68  1uF  [C0603]  101.14,138.44 90 bottom
C69  1uF  [C0603]  170.87,33.84 180 top
C70  1uF  [C0603]  95.18,45.59 0 bottom
C71  4.7uF  [C0603]  189.51,61.58 0 bottom
C72  1uF  [C0603]  189.51,62.98 0 bottom
C73  1uF  [C0603]  192.73,71.38 270 bottom
C74  100nF  [C0603]  194.19,71.38 270 bottom
C75  4.7uF  [C0603]  197.12,71.38 270 bottom
C76  1uF  [C0603]  198.58,71.38 270 bottom
C77  4.7uF  [C0603]  201.44,71.38 270 bottom
C78  4.7uF  [C0603]  200.01,71.38 270 bottom
C79  4.7uF  [C0603]  201.26,66.43 180 bottom
C80  220nF  [C0603]  201.26,64.98 180 bottom
C81  220nF  [C0603]  201.26,63.53 180 bottom
C82  1uF  [C0603]  196.9,85.84 270 bottom
C83  100nF  [C0603]  190.99,96.64 0 bottom
C84  100nF  [C0603]  203.5,96.64 180 bottom
C85  100nF  [C0603]  203.5,95.19 180 bottom
C86  2.2uF  [C0603]  91.5,140.3 90 bottom
C88  100nF  [C0603]  83.86,135.11 0 bottom
C90  100nF  [C0402]  263.46,55.99 180 bottom
C91  100nF  [C0402]  263.46,57.47 180 bottom
C93  33pF  [C0402]  262.06,56.73 90 bottom
C95  100nF  [C0603]  97.29,167 270 bottom
C100  100nF  [C0603]  51.95,19.01 90 bottom
C101  33pF  [C0603]  61.3,15.94 90 bottom
C102  33pF  [C0603]  55.91,15.99 270 bottom
C105  330pF  [C0603]  61.02,12.41 270 bottom
C106  330pF  [C0603]  56.15,12.46 90 bottom
C107  15pF  [C0603]  57.57,12.46 90 bottom
C109  15pF  [C0603]  59.59,12.41 90 bottom
C111  15pF  [C0603]  53.35,24.91 270 bottom
C112  100nF  [C0603]  53.37,16.04 90 bottom
C123  22pF  [C0603]  223.82,80.31 180 bottom
C124  1uF  [C0603]  220.22,80.96 270 bottom
C129  22nF  [C0603]  89.05,155.08 90 bottom
C133  12pF  [C0603]  93.37,123.57 180 bottom
C134  12pF  [C0603]  90.41,123.57 180 bottom
C135  4.7uF  [C0603]  89.21,162.29 180 bottom
C136  2.2uF  [C0603]  85.27,140.27 90 bottom
C137  22uF  [C0805]  213.71,181.6 90 bottom
C138  100nF  [C0603]  85.45,144.05 90 bottom
C139  2.2uF  [C0603]  86.91,144.05 90 bottom
C140  22uF  [C0805]  211.79,181.6 90 bottom
C144  100nF  [C0603]  98.16,135.09 180 bottom
C145  100nF  [C0603]  98.16,131.56 180 bottom
C146  100nF  [C0603]  90.04,140.3 90 bottom
C147  4.7uF  [C0603]  89.21,160.79 180 bottom
C148  100nF  [C0603]  92.96,140.3 270 bottom
C149  100nF  [C0603]  89.74,125.77 270 bottom
C150  1uF  [C0603]  229.82,102.01 0 top
C151  1uF  [C0603]  220.63,103.4 90 top
C152  10uF  [C0805]  221.26,88.08 180 top
C153  22uF  [C0805]  221.26,90.01 180 top
C154  1uF  [C0603]  220.33,92.45 270 top
C155  1uF  [C0603]  229.73,89.37 0 top
C156  1uF  [C0603]  222.04,103.41 90 top
C157  1uF  [C0603]  225.34,88.81 270 top
C158  1uF  [C0603]  213.55,105.09 180 bottom
C159  1uF  [C0603]  230.37,110.97 270 bottom
C160  1uF  [C0603]  237.48,99.08 0 bottom
C161  22uF  [C0805]  236.89,83.09 0 bottom
C162  1uF  [C0603]  213.5,90.95 180 bottom
C163  1uF  [C0603]  237.67,88.25 0 bottom
C164  1uF  [C0603]  236.86,86.69 0 bottom
C165  1uF  [C0603]  213.5,100.29 180 bottom
C166  4.7uF  [C0603]  88.43,170.97 90 bottom
C176  10uF  [C0805]  174.24,143.33 0 bottom
C177  100nF  [C0603]  64.14,22.77 0 bottom
C178  10uF  [C0805]  64.14,24.45 0 bottom
C179  15pF  [C0603]  53.36,21.98 90 bottom
C184  100nF  [C0603]  97.72,154.41 90 bottom
C185  100nF  [C0603]  99.14,154.41 90 bottom
C186  100nF  [C0603]  100.57,154.36 90 bottom
C187  100nF  [C0603]  101.96,154.36 90 bottom
C188  100nF  [C0603]  103.39,154.41 90 bottom
C189  100nF  [C0603]  104.8,154.41 90 bottom
C190  1uF  [C0603]  108.3,156.09 0 bottom
C191  1uF  [C0603]  108.29,157.51 0 bottom
C192  22pF  [C0603]  226.9,80.3 0 bottom
C201  220pF  [C0603]  10.41,158.42 0 bottom
C202  220pF  [C0603]  13.94,158.37 180 bottom
C203  1uF  [C0603]  190.98,89.44 0 bottom
C204  22uF  [C0805]  197.66,103.89 180 bottom
C205  22uF  [C0805]  197.66,101.94 180 bottom
C206  220pF  [C0603]  275.66,157.47 180 bottom
C207  220pF  [C0603]  272.17,157.47 0 bottom
C208  1uF  [C0603]  217.39,118.31 180 bottom
C209  100nF  [C0603]  138.41,54.24 270 bottom
C212  12pF  [C0603]  24.51,95.46 270 bottom
C213  4.7uF  [C0603]  29.85,95.46 90 bottom
C214  4.7uF  [C0603]  120.71,49.07 90 bottom
C220  100nF  [C0603]  49.19,61.72 180 bottom
C221  10nF  [C0603]  42.24,69.77 180 bottom
C222  22nF  [C0603]  42.24,75.52 180 bottom
C223  10uF  [C0805]  35.04,66.18 90 bottom
C224  22nF  [C0603]  38.11,66.18 270 bottom
C225  47uF  [C0805]  41.19,66.18 270 bottom
C226  1uF  [C0603]  30.43,77.35 0 bottom
C227  10nF  [C0603]  27.38,75.86 0 bottom
C228  10nF  [C0603]  27.38,72.27 0 bottom
C248  NC/1uF  [C0603]  202.78,91.62 270 bottom
D001  1N4148  [D_SOD123]  67.38,172.13 90 bottom
D003  1N4148  [D_SOD123]  168.66,77.7 180 bottom
D11  RED  [LED-8MM]  167.01,24.11 180 top
D502  SS54,SMA  [214AB]  215.35,175.01 0 bottom
EC1  Encoder  [5P-13.75X11.7X6.5H]  23.17,18.37 180 top
FB1  FB 220R/MH2012HM221-T  [L0805]  202.21,102.77 270 bottom
FB2  FB 220R  [L0805]  204.12,102.77 270 bottom
FB3  0R/0805/2A  [L0805]  216.24,72.79 90 bottom
FB4  0R/0805/2A  [L0805]  235.86,72.81 90 bottom
FB5  0R/0805/2A  [L0805]  108.5,154.29 180 bottom
FB6  10uH  [L0603]  195.66,71.38 90 bottom
FB7  FB 220R  [L0805]  192.36,102.77 270 bottom
FB8  FB 220R  [L0805]  190.44,102.78 270 bottom
FB9  FB 220R/MH2012HM221-T  [L0805]  174.2,68.1 270 bottom
FB10  10uH  [L0603]  189.51,60.18 180 bottom
FPC1  FPC_24PIN_0.5_4.3_1  [FPC_24PIN_0.5_4.3_1]  271.62,62.35 270 top
FPC4  NV116WHM  [30P*0.5MM]  107.79,171.54 180 bottom
FPC10  FPC_22PIN_0.5_4.3_1  [FPC_22PIN_0.5_4.3_1]  211.5,22.66 0 top
FPC11  FPC_15P_1.0  [FPC_P1.0MM_15P_SMD]  211.61,33.6 0 top
J1  H_22_2.54  [P4_2.54*4_VIA]  103.69,47.33 0 bottom
J2  Gas Sensor Socket  [MQ2]  33.43,49.38 270 top
J3  ST150(ZD)  [2*2P-IR928]  152.15,149.22 270 top
J4  H_22_2.54  [P4_2.54*4_VIA]  78.45,141.37 270 bottom
J5  PH2.0-4P  [4P-SMD-2.0]  167.69,9.01 0 top
J6  PH2.0-4P  [4P-SMD-2.0]  186.6,9.01 0 top
J9  SERVO_1  [1X03]  17.08,110.63 0 bottom
J10  SERVO_2  [1X03]  79.32,110.31 0 bottom
J11  CONN_20X2  [2X20]  249.54,156.84 180 top
J12  IR-3PSIP3  [VS1838B-SIP3]  115.91,49.98 180 top
J14  RGB6464AMD  [RGB64*64AMD]  106.07,154.21 0 top
J15  CONN_04  [1X04]  246.64,107.33 180 top
J21  PH2.0-4P  [4P-SMD-2.0]  110.97,8.91 0 top
J22  PH2.0-4P  [4P-SMD-2.0]  129.87,9.01 0 top
J23  SERVO  [4P-SMD-2.0]  148.78,9.01 0 top
J123  3.5MM3P  [3.5MM*3P]  163.55,51.58 180 top
J138  CROWPI_POW_SMD-2.54MM5P  [CROWPI_POW_SMD-5P*2.54]  180.17,159.07 180 bottom
J214  1X02L  [1X02L]  274.92,154.75 0 bottom
J215  1X02L  [1X02L]  13.21,154.99 0 bottom
J233  Ultrasonic  [ULTRA]  125.6,59.68 0 top
J313  MOTOR_1CN  [MOTOR_1CM]  199.49,173.22 270 top
K1  BUTTON_2P  [BUTTON_2P]  107.5,23.58 0 top
K2  BUTTON_2P  [BUTTON_2P]  120.58,23.58 0 top
K3  BUTTON_2P  [BUTTON_2P]  133.53,23.58 0 top
K4  BUTTON_2P  [BUTTON_2P]  146.61,23.58 0 top
K5  ROCKER  [ROCKER]  43.22,20.43 90 top
K6  BUTTON  [157SW]  82.87,144.24 90 bottom
K7  BUTTON  [157SW]  80.72,124.46 90 bottom
K10  [REY5-6-19.1X15.5X15.3MM]  163.55,65.93 270 top
K11  TILT-DIP-2P  [TILT]  223.95,170.45 180 top
L1  10UH 3A  [L773]  229.44,60.05 90 bottom
L2  3.3uH 3A  [L0420]  215.43,63.99 180 bottom
L3  22uH 3A  [L773]  223.82,175.26 0 bottom
L14  CD32_950MA  [CD32]  85.93,155.37 180 bottom
L103  2.2uH  [0805@1]  59.59,15.96 270 bottom
L104  2.2uH  [0805@1]  57.56,15.96 270 bottom
LED1  RED  [DISCRETE_LED-0603]  153.41,70.93 270 top
LED3  RED  [DISCRETE_LED-0603]  232.68,68.56 0 bottom
LED4  RED  [DISCRETE_LED-0603]  219.28,63.99 0 bottom
LED5  RED  [DISCRETE_LED-0603]  209.21,177.07 180 bottom
LED6  RED  [DISCRETE_LED-0603]  46.81,39.17 180 top
M1  M2  [M2]  265.14,143.09 0 top
M2  M2  [M2]  193.13,143.08 0 top
M3  M2  [M2]  193.11,32.78 0 top
M4  M2  [M2]  265.16,34.29 0 top
P1  PADPAD-1.0MM  [PAD-1.0MM]  86.75,164.42 90 bottom
P2  PADPAD-1.0MM  [PAD-1.0MM]  203.64,165.14 0 bottom
P3  PADPAD-1.0MM  [PAD-1.0MM]  89.42,59.14 90 bottom
P4  PADPAD-1.0MM  [PAD-1.0MM]  87.92,59.14 90 bottom
P5  PADPAD-1.0MM  [PAD-1.0MM]  88.02,48.74 90 bottom
P6  PADPAD-1.0MM  [PAD-1.0MM]  89.62,48.74 90 bottom
P7  PADPAD-1.0MM  [PAD-1.0MM]  244.13,109.64 0 bottom
P8  PADPAD-1.0MM  [PAD-1.0MM]  241.59,109.64 270 bottom
P9  PADPAD-1.0MM  [PAD-1.0MM]  252.72,154.4 0 bottom
P10  PADPAD-1.0MM  [PAD-1.0MM]  79.76,145.93 0 bottom
P11  PADPAD-1.0MM  [PAD-1.0MM]  249.5,159.88 0 bottom
P12  PADPAD-1.0MM  [PAD-1.0MM]  252.74,152.4 0 bottom
P13  PADPAD-1.0MM  [PAD-1.0MM]  87.32,85.7 0 bottom
P14  PADPAD-1.0MM  [PAD-1.0MM]  246.88,109.64 0 bottom
P15  PADPAD-1.0MM  [PAD-1.0MM]  230.98,82.35 0 bottom
P16  PADPAD-1.0MM  [PAD-1.0MM]  232.42,82.35 0 bottom
P17  PADPAD-1.0MM  [PAD-1.0MM]  132.86,12.4 90 bottom
P18  PADPAD-1.0MM  [PAD-1.0MM]  114.54,167.09 0 bottom
P19  PADPAD-1.0MM  [PAD-1.0MM]  237.89,71.92 90 bottom
P20  PADPAD-1.0MM  [PAD-1.0MM]  217.99,70.1 90 bottom
P21  PADPAD-1.0MM  [PAD-1.0MM]  13.18,160.26 0 bottom
P22  PADPAD-1.0MM  [PAD-1.0MM]  11.17,160.22 0 bottom
P23  PADPAD-1.0MM  [PAD-1.0MM]  274.87,159.47 0 bottom
P24  PADPAD-1.0MM  [PAD-1.0MM]  272.97,159.52 0 bottom
P25  PADPAD-1.0MM  [PAD-1.0MM]  151.99,131.79 0 bottom
P26  PADPAD-1.0MM  [PAD-1.0MM]  86.14,127.05 0 bottom
P27  PADPAD-1.0MM  [PAD-1.0MM]  177.81,26.58 0 bottom
P28  PADPAD-1.0MM  [PAD-1.0MM]  187.46,68.33 0 bottom
P29  PADPAD-1.0MM  [PAD-1.0MM]  187.46,66.63 0 bottom
P30  PADPAD-1.0MM  [PAD-1.0MM]  86.67,169.94 90 bottom
P31  PADPAD-1.0MM  [PAD-1.0MM]  95.11,151.65 90 bottom
P32  PADPAD-1.0MM  [PAD-1.0MM]  187.46,70.13 0 bottom
P33  PADPAD-1.0MM  [PAD-1.0MM]  11.93,113.51 0 bottom
P34  PADPAD-1.0MM  [PAD-1.0MM]  94.46,160.51 180 bottom
P35  PADPAD-1.0MM  [PAD-1.0MM]  74.2,113.48 0 bottom
P36  PADPAD-1.0MM  [PAD-1.0MM]  14.5,113.54 0 bottom
P37  PADPAD-1.0MM  [PAD-1.0MM]  79.27,113.55 0 bottom
P38  PADPAD-1.0MM  [PAD-1.0MM]  151.96,12.2 0 bottom
P39  PADPAD-1.0MM  [PAD-1.0MM]  145.76,12.2 0 bottom
P40  PADPAD-1.0MM  [PAD-1.0MM]  147.81,12.2 0 bottom
P41  PADPAD-1.0MM  [PAD-1.0MM]  149.91,12.2 0 bottom
P42  PADPAD-1.0MM  [PAD-1.0MM]  76.76,113.52 0 bottom
P43  PADPAD-1.0MM  [PAD-1.0MM]  17.02,113.48 0 bottom
P44  PADPAD-1.0MM  [PAD-1.0MM]  179.37,134.49 180 bottom
P45  PADPAD-1.0MM  [PAD-1.0MM]  179.37,133.11 180 bottom
P46  PADPAD-1.0MM  [PAD-1.0MM]  179.37,131.72 180 bottom
P47  PADPAD-1.0MM  [PAD-1.0MM]  179.37,130.34 180 bottom
P48  PADPAD-1.0MM  [PAD-1.0MM]  97.74,156.59 90 bottom
P49  PADPAD-1.0MM  [PAD-1.0MM]  99.15,156.59 90 bottom
P50  PADPAD-1.0MM  [PAD-1.0MM]  100.56,156.64 90 bottom
P51  PADPAD-1.0MM  [PAD-1.0MM]  101.97,156.59 90 bottom
P52  PADPAD-1.0MM  [PAD-1.0MM]  103.38,156.64 90 bottom
P53  PADPAD-1.0MM  [PAD-1.0MM]  104.79,156.59 90 bottom
P54  PADPAD-1.0MM  [PAD-1.0MM]  109.44,166.49 90 bottom
P55  PADPAD-1.0MM  [PAD-1.0MM]  34.12,96.23 0 bottom
P56  PADPAD-1.0MM  [PAD-1.0MM]  93.49,170.05 270 bottom
P57  PADPAD-1.0MM  [PAD-1.0MM]  27.06,69.48 180 bottom
P58  PADPAD-1.0MM  [PAD-1.0MM]  110.84,166.49 90 bottom
P59  PADPAD-1.0MM  [PAD-1.0MM]  178.93,126.26 0 bottom
P60  PADPAD-1.0MM  [PAD-1.0MM]  179,124.39 0 bottom
P61  PADPAD-1.0MM  [PAD-1.0MM]  111.39,28.06 0 bottom
P62  PADPAD-1.0MM  [PAD-1.0MM]  43.23,6.62 0 bottom
P63  PADPAD-1.0MM  [PAD-1.0MM]  46.12,20.44 0 bottom
P64  PADPAD-1.0MM  [PAD-1.0MM]  112.44,166.49 90 bottom
P65  PADPAD-1.0MM  [PAD-1.0MM]  106.23,166.59 90 bottom
P66  TEST_PAD  [TEST_PAD-1.0MM]  40.89,86.83 0 bottom
P67  PADPAD-1.0MM  [PAD-1.0MM]  100.42,166.67 0 bottom
P68  PADPAD-1.0MM  [PAD-1.0MM]  276.58,64.78 0 bottom
P69  PADPAD-1.0MM  [PAD-1.0MM]  79.76,145.03 270 top
P70  PADPAD-1.0MM  [PAD-1.0MM]  18.74,64.54 0 bottom
P71  PADPAD-1.0MM  [PAD-1.0MM]  277.63,65.98 0 bottom
P72  PADPAD-1.0MM  [PAD-1.0MM]  276.56,67.22 0 bottom
P73  PADPAD-1.0MM  [PAD-1.0MM]  77.16,145.03 270 top
P74  PADPAD-1.0MM  [PAD-1.0MM]  80.74,135.48 0 bottom
P75  IO_RGB  [PAD-1.0MM]  80.74,131.55 0 bottom
P76  PADPAD-1.0MM  [PAD-1.0MM]  80.74,133.41 0 bottom
P77  PADPAD-1.0MM  [PAD-1.0MM]  128.86,12.4 90 bottom
P78  PADPAD-1.0MM  [PAD-1.0MM]  126.92,12.4 90 bottom
P79  PADPAD-1.0MM  [PAD-1.0MM]  130.91,12.4 90 bottom
P80  PADPAD-1.0MM  [PAD-1.0MM]  189.61,12.4 0 bottom
P81  PADPAD-1.0MM  [PAD-1.0MM]  183.58,12.5 0 bottom
P82  PADPAD-1.0MM  [PAD-1.0MM]  164.68,12.7 0 bottom
P83  PADPAD-1.0MM  [PAD-1.0MM]  187.63,12.4 0 bottom
P84  PADPAD-1.0MM  [PAD-1.0MM]  236.63,169.92 0 bottom
P85  PADPAD-1.0MM  [PAD-1.0MM]  277.69,63.73 0 bottom
P86  PADPAD-1.0MM  [PAD-1.0MM]  276.64,62.6 0 bottom
P87  PADPAD-1.0MM  [PAD-1.0MM]  277.69,61.43 0 bottom
P88  PADPAD-1.0MM  [PAD-1.0MM]  276.64,60.3 0 bottom
P89  PADPAD-1.0MM  [PAD-1.0MM]  277.69,59.13 0 bottom
P90  PADPAD-1.0MM  [PAD-1.0MM]  276.64,58 0 bottom
P91  PADPAD-1.0MM  [PAD-1.0MM]  277.69,56.83 0 bottom
P92  PADPAD-1.0MM  [PAD-1.0MM]  276.64,55.71 0 bottom
P93  PADPAD-1.0MM  [PAD-1.0MM]  277.69,54.53 0 bottom
P94  PADPAD-1.0MM  [PAD-1.0MM]  276.64,53.41 0 bottom
P95  PADPAD-1.0MM  [PAD-1.0MM]  277.69,52.24 0 bottom
P96  PADPAD-1.0MM  [PAD-1.0MM]  276.64,51.11 0 bottom
P97  PADPAD-1.0MM  [PAD-1.0MM]  277.69,49.94 0 bottom
P98  PADPAD-1.0MM  [PAD-1.0MM]  277.69,68.5 0 bottom
P99  PADPAD-1.0MM  [PAD-1.0MM]  277.69,47.64 0 bottom
P100  PADPAD-1.0MM  [PAD-1.0MM]  276.64,48.71 0 bottom
P101  KEY  [1P-D450]  23,88.11 0 top
P102  PADPAD-1.0MM  [PAD-1.0MM]  121.06,169.53 0 bottom
P104  TEST_PAD  [TEST_PAD-1.0MM]  45.49,86.83 0 bottom
P105  IO_RGB  [PAD-1.0MM]  100.94,135.92 0 bottom
P106  IO_RGB  [PAD-1.0MM]  100.94,134.26 0 bottom
P107  IO_RGB  [PAD-1.0MM]  100.97,132.59 0 bottom
P108  IO_RGB  [PAD-1.0MM]  101,130.93 0 bottom
P109  PADPAD-1.0MM  [PAD-1.0MM]  157.33,121.35 0 bottom
P110  PADPAD-1.0MM  [PAD-1.0MM]  125.42,55.65 0 bottom
P111  PADPAD-1.0MM  [PAD-1.0MM]  123.86,55.63 0 bottom
P112  PADPAD-1.0MM  [PAD-1.0MM]  116.12,54.22 0 bottom
P113  PADPAD-1.0MM  [PAD-1.0MM]  105.28,39.78 0 bottom
P114  PADPAD-1.0MM  [PAD-1.0MM]  78.47,169.05 0 bottom
P115  PADPAD-1.0MM  [PAD-1.0MM]  152.55,66.04 0 bottom
P116  PADPAD-1.0MM  [PAD-1.0MM]  24.02,46.94 0 bottom
P117  PADPAD-1.0MM  [PAD-1.0MM]  238.97,109.57 0 bottom
Q1  S9013  [SOT23-3]  232.27,181.83 270 bottom
Q2  AO3401  [PMOS_SOT23]  232.23,178.61 270 bottom
Q3  S9013  [SOT23@1]  173.75,24.32 270 bottom
Q4  S9013  [SOT23@1]  260.64,60.51 90 bottom
Q5  S9013  [SOT23@1]  141.98,121.63 180 bottom
Q6  AO3401A  [PMOS_SOT23]  119.14,12.34 270 bottom
Q7  BSS138  [SOT23]  20.43,103.41 270 bottom
Q8  BSS138  [SOT23]  84.27,107.62 270 bottom
Q9  AO3401A  [PMOS_SOT23]  157.04,11.04 270 bottom
Q101  S9013  [SOT23@1]  112.99,163.5 0 bottom
Q102  S9013  [SOT23@1]  106.49,163.48 0 bottom
Q103  S9013  [SOT23@1]  76.02,165.16 180 bottom
Q104  S9013  [SOT23@1]  196.19,164.63 90 top
Q106  BSS138  [SOT23]  129.05,133.17 270 bottom
Q107  BSS138  [SOT23]  125.13,133.19 90 bottom
Q108  S9013  [SOT23@1]  141.89,126.68 180 bottom
Q112  NC/S9013  [SOT23@1]  203.77,88.45 90 bottom
Q115  S9013  [SOT23@1]  153.29,72.28 0 bottom
R1  100K  [R0603]  123.24,15.64 180 bottom
R2  150K  [R0603]  235.21,62.7 90 bottom
R3  33K  [R0603]  238.04,62.7 270 bottom
R4  10K  [R0603]  239.95,56.64 90 bottom
R5  100K  [R0603]  239.95,59.58 270 bottom
R6  49.9K  [R0603]  212.64,59.82 90 bottom
R7  59K  [R0603]  212.64,56.87 90 bottom
R8  10K  [R0603]  211.14,56.86 90 bottom
R9  100K  [R0603]  211.15,59.82 270 bottom
R10  10K  [R0603]  235.12,178.64 270 bottom
R11  100K  [R0603]  235.09,181.88 270 bottom
R12  1K  [R0603]  236.53,181.87 90 bottom
R13  5.1R  [R0603]  23.25,42.26 180 bottom
R14  4.7K  [R0603]  23.99,44.44 270 bottom
R15  MF52A103F3950  [RES-TH_L2.5-W2.5-P1.70-D0.3]  19.92,67.55 270 top
R16  10K  [R0603]  24.37,66.96 180 top
R17  10K  [R0603]  117.94,120.94 180 bottom
R18  NC  [R0603]  69.39,66.93 180 top
R19  NC  [R0603]  69.38,65.36 180 top
R20  NC  [R0603]  277.29,70.38 0 bottom
R21  10K  [R0603]  176.33,24.34 90 bottom
R22  270R  [R0603]  158.09,131.83 270 bottom
R23  4.7K  [R0603]  41.23,13.75 90 bottom
R24  1K  [R0603]  177.81,24.36 90 bottom
R25  470R  [R0603]  174.55,26.72 0 bottom
R26  10K  [R0603]  152.92,128.08 270 bottom
R27  10K  [R0603]  155.36,131.83 270 bottom
R28  10K  [R0603]  156.73,131.83 270 bottom
R29  4.7K  [R0603]  175.39,120.7 0 bottom
R30  4.7K  [R0603]  47.3,22.38 180 bottom
R31  4.7K  [R0603]  66.28,86.63 90 top
R32  1K  [R0603]  140.41,124.14 180 bottom
R33  1K  [R0603]  91.16,125.77 90 bottom
R34  0R  [R0603]  86.73,140.3 90 bottom
R35  1K  [R0603]  85.49,147.03 270 bottom
R36  10K  [R0603]  86.89,147 270 bottom
R37  0R  [R0603]  197.66,105.57 180 bottom
R38  10K  [R0603]  203.55,93.76 180 bottom
R39  0R  [R0603]  83.86,129.94 0 bottom
R40  NC  [R0603]  190.99,90.89 180 bottom
R41  10K  [R0603]  190.99,92.33 0 bottom
R42  10K  [R0603]  99.87,114.95 180 bottom
R43  4.7K  [R0603]  45.24,13.7 90 bottom
R45  4.7K  [R0603]  47.66,18.51 180 bottom
R49  0R  [R0402]  266.09,61.21 180 bottom
R50  0R  [R0402]  266.09,62.14 180 bottom
R51  0R  [R0402]  266.09,63.06 180 bottom
R52  0R  [R0402]  266.09,63.99 180 bottom
R53  0R  [R0402]  266.09,64.92 180 bottom
R54  0R  [R0402]  266.09,65.84 180 bottom
R57  0R  [R0402]  266.09,66.77 180 bottom
R58  0R  [R0402]  266.09,67.7 180 bottom
R61  1M  [R0402]  266.09,57.5 180 bottom
R62  NC/4.7K  [R0402]  266.12,55.99 180 bottom
R63  10K  [R0603]  84.55,84.84 90 top
R64  10K  [R0603]  24.47,32.49 90 bottom
R65  10K  [R0603]  22.7,32.49 90 bottom
R66  0R  [R0402]  266.09,59.36 180 bottom
R67  100R  [R0402]  266.12,53.25 180 bottom
R68  100R  [R0402]  266.12,51.43 0 bottom
R69  NC/4.7K  [R0402]  266.12,52.34 180 bottom
R70  100K  [R0402]  266.12,50.51 0 bottom
R71  470R  [R0603]  24.96,8.84 90 bottom
R72  4.7K  [R0603]  25.25,30.3 0 bottom
R73  4.7K  [R0603]  21.95,30.29 180 bottom
R74  2K  [R0603]  22.12,8.84 90 bottom
R75  47K  [R0603]  123.24,14.24 180 bottom
R76  47K  [R0603]  161.04,13.14 180 bottom
R77  10K  [R0603]  143.28,129.33 180 bottom
R79  4.7k  [R0603]  197.49,57.93 270 bottom
R81  4.7K  [R0603]  153.41,73.83 90 top
R82  0R  [R0603]  38.69,89.63 180 bottom
R83  0R  [R0603]  38.69,88.13 180 bottom
R84  4.7K  [R0603]  46.69,89.08 90 top
R85  4.7K  [R0603]  39.59,89.08 90 top
R87  10K  [R0603]  117.94,122.44 180 bottom
R88  NC/4.7K  [R0402]  266.09,58.43 0 bottom
R89  10K  [R0603]  117.94,123.94 180 bottom
R90  0R  [R0402]  263.47,52.36 180 bottom
R91  1M  [R0402]  266.12,55.07 0 bottom
R92  1K  [R0402]  263.46,55.07 0 bottom
R93  1K  [R0402]  263.46,58.39 0 bottom
R94  10K  [R0603]  152.92,125.28 270 bottom
R95  100R  [R0402]  266.09,60.28 180 bottom
R96  4.7K  [R0402]  257.33,60.51 270 bottom
R97  100K  [R0402]  258.25,60.51 270 bottom
R98  10K  [R0402]  266.12,54.16 180 bottom
R99  0R  [R0402]  263.43,59.3 180 bottom
R100  100K  [R0603]  161.04,14.54 180 bottom
R101  4.7K  [R0603]  49.63,39.15 0 top
R102  NC  [R0603]  200.36,57.93 90 bottom
R103  NC  [R0603]  221.5,111.01 90 bottom
R104  10K  [R0603]  89.21,163.73 0 bottom
R105  NC  [R0603]  89.84,170.97 90 bottom
R106  NC  [R0603]  86.5,166.94 90 bottom
R107  1K  [R0603]  95.1,154.14 90 bottom
R108  4.7K  [R0603]  91.44,160.12 270 bottom
R109  10K  [R0603]  95.11,157.05 270 bottom
R110  4.7k  [R0603]  198.26,60.13 180 bottom
R111  NC  [R0603]  189.51,64.98 180 bottom
R112  100R  [R0603]  153.27,68.08 180 bottom
R113  10K  [R0603]  137.74,51.95 0 bottom
R114  12K  [R0603]  229.75,104.9 180 top
R115  22R  [R0603]  191.27,71.38 270 bottom
R116  22R  [R0603]  189.81,71.38 270 bottom
R125  22R  [R0603]  143.67,6.96 180 bottom
R126  0R  [R0603]  218.76,80.94 90 bottom
R127  10K  [R0603]  172.44,120.72 180 bottom
R128  0R  [R0603]  59.59,9.46 270 bottom
R129  0R  [R0603]  57.57,9.46 270 bottom
R130  22R  [R0603]  143.67,5.54 180 bottom
R131  4.7K  [R0603]  23.32,103.36 90 bottom
R132  4.7K  [R0603]  87.32,107.52 90 bottom
R133  4.7K  [R0603]  20.83,106.01 0 bottom
R134  4.7K  [R0603]  84.27,110.22 0 bottom
R135  0R  [R0603]  102.54,42.21 270 bottom
R136  0R  [R0603]  104.04,42.21 270 bottom
R140  1K  [R0603]  116.86,52.53 180 bottom
R153  4.7K  [R0603]  232.66,67.13 180 bottom
R154  2K  [R0603]  219.33,65.38 0 bottom
R155  10K  [R0603]  209.26,178.48 180 bottom
R178  10K  [R0603]  110.52,163.14 270 bottom
R179  1K  [R0603]  114,160.07 270 bottom
R180  10K  [R0603]  112.07,160.07 270 bottom
R181  10K  [R0603]  109.06,163.09 270 bottom
R182  1K  [R0603]  107.56,160.09 270 bottom
R183  10K  [R0603]  105.65,160.09 270 bottom
R184  0R  [R0603]  221.65,80.94 270 bottom
R185  5.1M  [R0603]  225.36,81.74 0 bottom
R186  NC  [R0603]  229.78,103.44 0 top
R187  10K  [R0603]  219.62,111.01 90 bottom
R188  NC  [R0603]  218.2,111.01 90 bottom
R189  NC  [R0603]  27.38,70.88 0 bottom
R209  47K  [R0603]  198.34,88.79 270 bottom
R210  47K  [R0603]  196.87,88.79 270 bottom
R213  0R  [R0603]  190.99,93.77 180 bottom
R216  NC/100K  [R0603]  190.99,95.21 180 bottom
R217  NC/4.7K  [R0603]  201.14,85.48 90 bottom
R218  4.7K  [R0603]  204.31,91.61 270 bottom
R219  30.9K  [R0603]  89.21,159.37 0 bottom
R221  0R  [R0603]  94.49,162.86 90 bottom
R231  10K  [R0603]  83.86,128.52 180 bottom
R232  NC  [R0603]  231.67,115.83 180 bottom
R233  10K  [R0603]  231.61,117.31 0 bottom
R234  10K  [R0603]  231.72,114.35 0 bottom
R235  NC  [R0603]  231.62,118.81 0 bottom
R236  10K  [R0603]  217.38,116.87 0 bottom
R237  10K  [R0603]  135.55,54.21 90 bottom
R238  NC  [R0603]  134.1,54.24 270 bottom
R239  4.7K  [R0603]  139.84,54.26 270 bottom
R240  4.7K  [R0603]  141.26,54.26 270 bottom
R242  10K  [R0603]  42.24,71.21 180 bottom
R243  0R  [R0603]  42.24,72.65 0 bottom
R244  130K  [R0603]  42.24,74.09 0 bottom
R245  500K  [3P-SMD-SQUA-3.6X3.3]  37.91,68.18 270 top
R246  1K  [R0603]  33.37,66.18 90 bottom
R247  1M  [R0603]  36.7,66.18 270 bottom
R248  4.7K  [R0603]  39.52,66.18 90 bottom
R249  10K  [R0603]  42.24,78.4 180 bottom
R250  1M  [R0603]  42.24,76.96 180 bottom
R251  10K  [R0603]  30.43,78.77 0 bottom
R252  1M  [R0603]  30.43,75.86 0 bottom
R253  10K  [R0603]  30.43,72.26 0 bottom
R254  2K  [R0603]  30.43,70.88 0 bottom
R255  10K  [R0603]  30.43,69.48 0 bottom
R256  NC  [R0603]  30.43,68.11 180 bottom
R257  4.7K  [R0603]  129.25,136.97 0 bottom
R258  NC  [R0603]  129.25,135.52 0 bottom
R259  4.7K  [R0603]  124.94,136.96 180 bottom
R260  NC  [R0603]  124.94,135.51 180 bottom
R268  10K  [3P-SMD-SQUA-3.6X3.3]  99.84,114.95 180 top
R272  0R  [R0603]  83.86,131.37 0 bottom
R273  10K  [R0603]  153.27,69.53 180 bottom
R276  22R  [R0603]  173.5,72.02 0 bottom
R280  10K  [R0603]  198.86,164.63 270 top
R282  1K  [R0603]  200.28,164.63 270 top
R283  22R  [R0603]  192.27,164.67 90 top
R284  100R  [R0603]  76.02,169.11 0 bottom
R286  10K  [R0603]  31.29,95.44 90 bottom
R287  1K  [R0603]  32.72,95.45 90 bottom
R288  10K  [R0603]  27.38,98.72 0 bottom
R292  22R  [R0603]  182.32,143.01 90 bottom
R293  22R  [R0603]  180.85,143.01 90 bottom
R294  22R  [R0603]  179.38,143.01 90 bottom
R297  22R  [R0603]  183.78,143.01 90 bottom
R298  0R  [R0603]  233.47,170.01 0 top
R299  2K  [R0603]  126.88,56.56 270 bottom
R302  10K  [R0603]  76.02,167.68 0 bottom
R303  22R  [R0603]  64.25,172.13 90 bottom
R308  10K  [R0603]  60.09,27.86 270 bottom
R321  1K  [R0603]  140.33,129.31 0 bottom
R324  10K  [R0603]  143.41,124.13 0 bottom
R325  10K  [R0603]  64.14,21.35 0 bottom
R328  5.1K  [R0603]  51.95,16.04 270 bottom
R332  NC  [R0603]  201.13,88.48 90 bottom
R364  1K  [R0603]  233.47,171.44 0 top
R367  820R  [R0603]  53.37,19.01 90 bottom
R501  200K  [R0603]  217.43,180.68 180 bottom
R502  10K  [R0603]  217.42,182.12 0 bottom
R514  240K  [R0603]  225.77,181.53 270 bottom
R639  1K  [R0603]  113.62,27.25 90 bottom
R652  2.7K  [R0603]  115.04,27.25 90 bottom
R653  3.74K  [R0603]  128.17,27.25 90 bottom
R654  5.6K  [R0603]  141.29,27.25 90 bottom
R655  8.2K  [R0603]  154.16,27.25 90 bottom
RP1  [3P-SQUA-45.6X10X5.8H]  129.75,36.22 0 top
SW1  switch_6pin  [SWITCH_6PIN_2P]  48.11,45.19 90 top
U1  MT2496-SOT23-6  [SOT23-6L]  236.77,58.24 180 bottom
U2  LSM6DS3TR-C  [LGA-14L]  43.14,89.08 0 top
U4  KTH1701FH-ST3  [SOT-23W]  84.51,90.97 0 top
U6  RT9013-33GB-MS  [SOT23-5]  104.04,138.34 180 bottom
U7  RT9013-33GB-MS  [SOT23-5]  170.76,37.03 0 top
U8  MMDT3906  [SOT-363]  157.14,14.24 0 bottom
U9  DHT20  [CROWTAIL-DHT20-V1.0-20211013_DHT20]  74.53,67.52 270 top
U11  MT3520B  [IC_SOT23-5]  215.43,58.3 180 bottom
U13  SPL06-001  [LGA8-0.65-2X2.5X0.95MM]  65.29,90.54 90 top
U16  TCA9534APWR  [SOP65P640X120-16N]  173.87,124.67 180 bottom
U17  W25Q80  [LORA_RA-08H_DEV_SELF_SOIC-8-208MIL]  224.54,116.38 0 bottom
U18  KT0210-QFN40-EP  [QFN40_EP]  195.56,64.83 90 bottom
U19  WMM7027ATSN1-4/TR  [LGA-4(1.9X2.8)]  166.66,36.83 0 top
U24  SN74LVC1G125  [SOT23-5']  94.47,166.96 0 bottom
U25  MT2492  [MT2492-SOT23-6]  92.11,155.49 180 bottom
U27  RP2040_RP2040  [RP2040_QFN-56]  91,132.5 0 bottom
U29  SELF_W25Q128JV  [SELF_SOIC-8-208MIL]  93.12,145.37 180 bottom
U31  STC8H1K28-36I-LQFP32  [QFP80P900X900X165-32N]  94.22,53.54 0 bottom
U35  MMDT3906  [SOT-363]  119.34,15.24 0 bottom
U39  PCF8574DWR(UMW)  [SO-16-300MIL]  121.84,120.94 90 bottom
U103  LPW5206AB5F  [IC_SOT23-5']  89.21,166.96 180 bottom
U114  ULN2003D  [ULN2003D]  171.65,130.51 180 bottom
U115  MFRC522  [RC522]  61.09,23.89 0 bottom
U119  RTD2556  [IC_RTD2556_LQFP156_14X20]  225.38,96.1 90 bottom
U120  [SSOP24]  200.29,99.22 270 bottom
U121  BH1750  [B1750]  136.4,49.42 0 top
U123  TTP223  [SOT23-6L']  27.31,95.46 0 bottom
U125  LM358  [SOP8@1]  156.63,125.78 0 bottom
U126  BISS0001DRG  [SOP16]  33.7,69.56 90 bottom
U131  D203S  [PIR_MOTION_SENSOR_3P-D8.1MM]  49.36,68.32 270 top
U205  HT16K33-20P  [HT16K33-SOP20]  244.24,27.13 180 bottom
U215  YY2841AS-33  [4-DIGITAL_DISPLAY]  243.64,15.37 0 top
U235  LCD1602  [LCD1206]  120.23,111.68 0 top
U501  MT3608  [MT3608-SOT23-6]  221.82,181.53 90 bottom
U$66  PADPAD1  [PAD_5*3]  137.21,152.95 0 top
U$69  PADPAD1  [PAD_5*3]  137.21,148.54 0 top
U$70  PADPAD1  [PAD_5*3]  173.11,152.95 0 top
U$71  PADPAD1  [PAD_5*3]  173.11,148.54 0 top
U$164  PADPAD1  [PAD_5*3]  147.66,148.5 0 bottom
U$165  PADPAD1  [PAD_5*3]  162.66,148.5 0 bottom
X2  12MHZ_SMD3225  [A_XBJ_SMD3225]  91.85,121.06 0 bottom
X101  X32251431818MSB4SI  [CRYSTAL-3.2-2.5]  225.31,77.94 180 bottom
X102  27.12MHZ  [CRYSTAL-3.2-2.5]  50.96,23 270 bottom

## Tracks (layer width: path | path; a pad name or v marks a point on that pad's centre or on a via)
1V1_LCD
  Bottom 0.2: R6.2 212.64,63.85 214.98,66.19 L2.2 217.76,66.19 R154.2 | C11.2 216.29,70.05 | 216.29,70.05 C12.2 | FB3.1 216.29,71.85 216.29,70.05
  pour Bottom: 214.34,65.6 214.34,66.75 214.39,66.8 215.54,66.8 215.64,66.9 215.64,70.75 215.74,70.85 218.44,70.85 218.59,70.7 218.59,65.85 218.34,65.6
2
  cutout Bottom: 66.6,5.87 97.69,5.87 97.69,43.42 66.6,43.42
3V3_AU  (via drill 0.3)
  Top 0.152: 219.41,83.44 219.4,83.43 v219.18,83.43
  Top 0.2: v221.47,83.44 219.41,83.44
  Bottom 0.2: R126.2 218.76,82.96 219.18,83.38 v219.18,83.43 U119.156 | U119.150 221.58,83.45 221.59,83.44 v221.47,83.44
3V3_IO  (via drill 0.3)
  Top 0.4: J6.3 187.65,8.97 v187.65,11.44 | v149.85,11.24 149.78,11.18 J23.3 | J5.3 168.69,11 v168.65,11.04
  Bottom 0.2: Q9.2 156.95,11.27 156.95,13.14 156.5,13.59 U8.4
  Bottom 0.4: P41.P$1 149.85,12.13 v149.85,11.24 151,10.09 158,10.09 Q9.2 158.13,10.09 168.65,10.09 | P83.P$1 187.6,12.38 187.65,12.33 v187.65,11.44 187.65,10.44 187.19,9.99 168.65,9.99 168.65,10.09 | v168.65,11.04 168.65,10.09
3V3_LCD  (via drill 0.3, 0.4)
  Top 0.2: 189.15,90.84 v189.1,90.89 188.55,90.34 188.55,85.84 190.23,84.15 v205.61,84.15 207.23,84.15 207.65,83.74
  Top 1: v123.25,154.24 123.65,154.24 137.79,140.1 164.39,140.1 169.45,135.04 192.35,135.04 v196.65,130.74 v196.65,129.74 | v233.45,72.24 233.15,71.94 | 233.15,71.94 v233.45,71.64 | 233.15,71.94 219.45,71.94 207.65,83.74 207.65,85.64 v207.35,85.94 v207.95,85.94
  Bottom 0.2: R40.1 v189.1,90.89 | 204.41,90.94 R218.2 205.6,89.56 205.6,89.08 205.61,89.07 v205.61,84.15 | R153.2 235.81,67.13 C3.2 | R90.1 255.23,52.36 241.84,65.75 241.84,69.35 239.27,71.92 P19.P$1 FB4.1 235.86,68.87 C4.2 235.96,67.23 C3.2 | C3.2 C2.2
  Bottom 1: FB4.1 233.77,71.92 | 233.77,71.92 v233.45,72.24 | 233.77,71.92 233.72,71.92 v233.45,71.64 | 207.65,86.24 207.65,104.24 196.65,115.24 v196.65,129.74 v196.65,130.74 | 207.65,86.24 v207.35,85.94 | 207.65,86.24 v207.95,85.94
  Bottom 1.016: v123.25,154.24 122.55,154.24 109.44,154.24 FB5.2
  pour Bottom: 236.49,72.42 236.49,64.52 237.14,63.87 237.14,63.02 237.04,62.92 234.59,62.92 233.04,61.37 227.79,61.37 227.44,61.72 227.44,64.07 227.64,64.27 234.74,64.27 235.09,64.62 235.09,72.42
3V3_LCD_S
  Bottom 0.152: FB5.1 107.54,154.37 C190.2 C191.2
  Bottom 0.2: R178.2 109.12,162.38 R181.2 109.02,162.33 107.86,163.49 104.25,163.49 | P65.P$1 106.24,166.63 106.65,167.04
  Bottom 0.254: FPC4.P$12 106.95,167.74 107.15,167.54 107.45,167.84 FPC4.P$13
  Bottom 1.016: FB5.1 107.62,157.27 105.66,159.23 R183.2 104.76,159.33 104.25,159.84 104.25,163.49 104.25,164.64 106.65,167.04 107.15,167.54
4
  cutout Top: 66.6,5.78 97.69,5.78 97.69,43.43 66.6,43.43
5V_BL_DC
  Bottom 0.2: C13.2 229.5,180.73 229.69,180.73
  Bottom 0.61: C13.2 231.21,178.86 Q2.3
  pour Bottom: 232.04,180.18 228.29,180.18 227.99,179.88 227.99,173.58 227.84,173.43 225.64,173.43 225.39,173.68 225.39,180.23 225.29,180.23 224.34,181.18 222.54,181.18 222.44,181.28 222.44,181.83 222.54,181.93 224.64,181.93 225.24,181.33 232.04,181.33 232.09,181.28 232.09,180.23
5V_IO  (via drill 0.3)
  Top 0.4: v130.85,11.34 130.87,11.31 J22.3 | v112.05,10.94 112.05,8.99 J21.3
  Bottom 0.2: U35.4 119.15,13.87 119.15,12.47 Q6.2
  Bottom 0.4: v130.85,11.34 130.85,12.34 | 130.85,12.34 P79.P$1 | 130.85,12.34 129.93,13.25 125.56,13.25 123.76,11.45 Q6.2 112.36,11.45 112.05,11.14 v112.05,10.94
5V_SERVO_1
  Bottom 0.152: J10.3 74.24,109.6 74.21,109.58
  Bottom 0.2: R134.2 83.5,107.87 Q8.3 | Q8.3 83.6,107.27 | P35.P$1 | Q8.3 76.17,107.62 74.21,109.58 | P35.P$1 74.21,113.47 | P35.P$1 74.2,110.35 J10.3
5V_SERVO_2
  Bottom 0.152: J9.3 11.93,110.7 11.93,110.85
  Bottom 0.2: Q7.3 15.93,103.41 11.93,107.41 11.93,110.85 11.93,110.99 P33.P$1 | Q7.3 19.62,103.61 | Q7.3 19.42,105.36 R133.2
12V_LCD_BL
  Bottom 0.152: C140.1 211.74,180.76 C48.1 C47.1
  Bottom 0.2: D502.2 212.85,179.86 C137.1 213.74,180.68 R501.1 | 114.35,167.04 114.5,167.04 P18.P$1 115.4,167.09 115.45,167.14 | R155.2 210.02,180.42 210.32,180.72 C140.1
  Bottom 0.254: FPC4.P$28 114.95,167.64 114.45,167.14 | FPC4.P$29 115.45,167.14 115.35,167.04 | FPC4.P$26 113.95,167.44 114.3,167.09 114.35,167.04 114.45,167.14 | FPC4.P$27 114.45,167.14
  Bottom 1: C140.1 211.76,180.74 181.65,180.74 180.65,181.74 135.95,181.74 121.3,167.09 P18.P$1 114.3,167.09
  pour Bottom: 214.44,181.23 214.44,173.58 214.19,173.33 211.09,173.33 211.09,181.13 211.24,181.28 214.39,181.28
+1V1